# EAGLE schematic bfc (EAGLE 9.6.1)

## Sheet 1 of 5: Flight Computers & PC104 Header
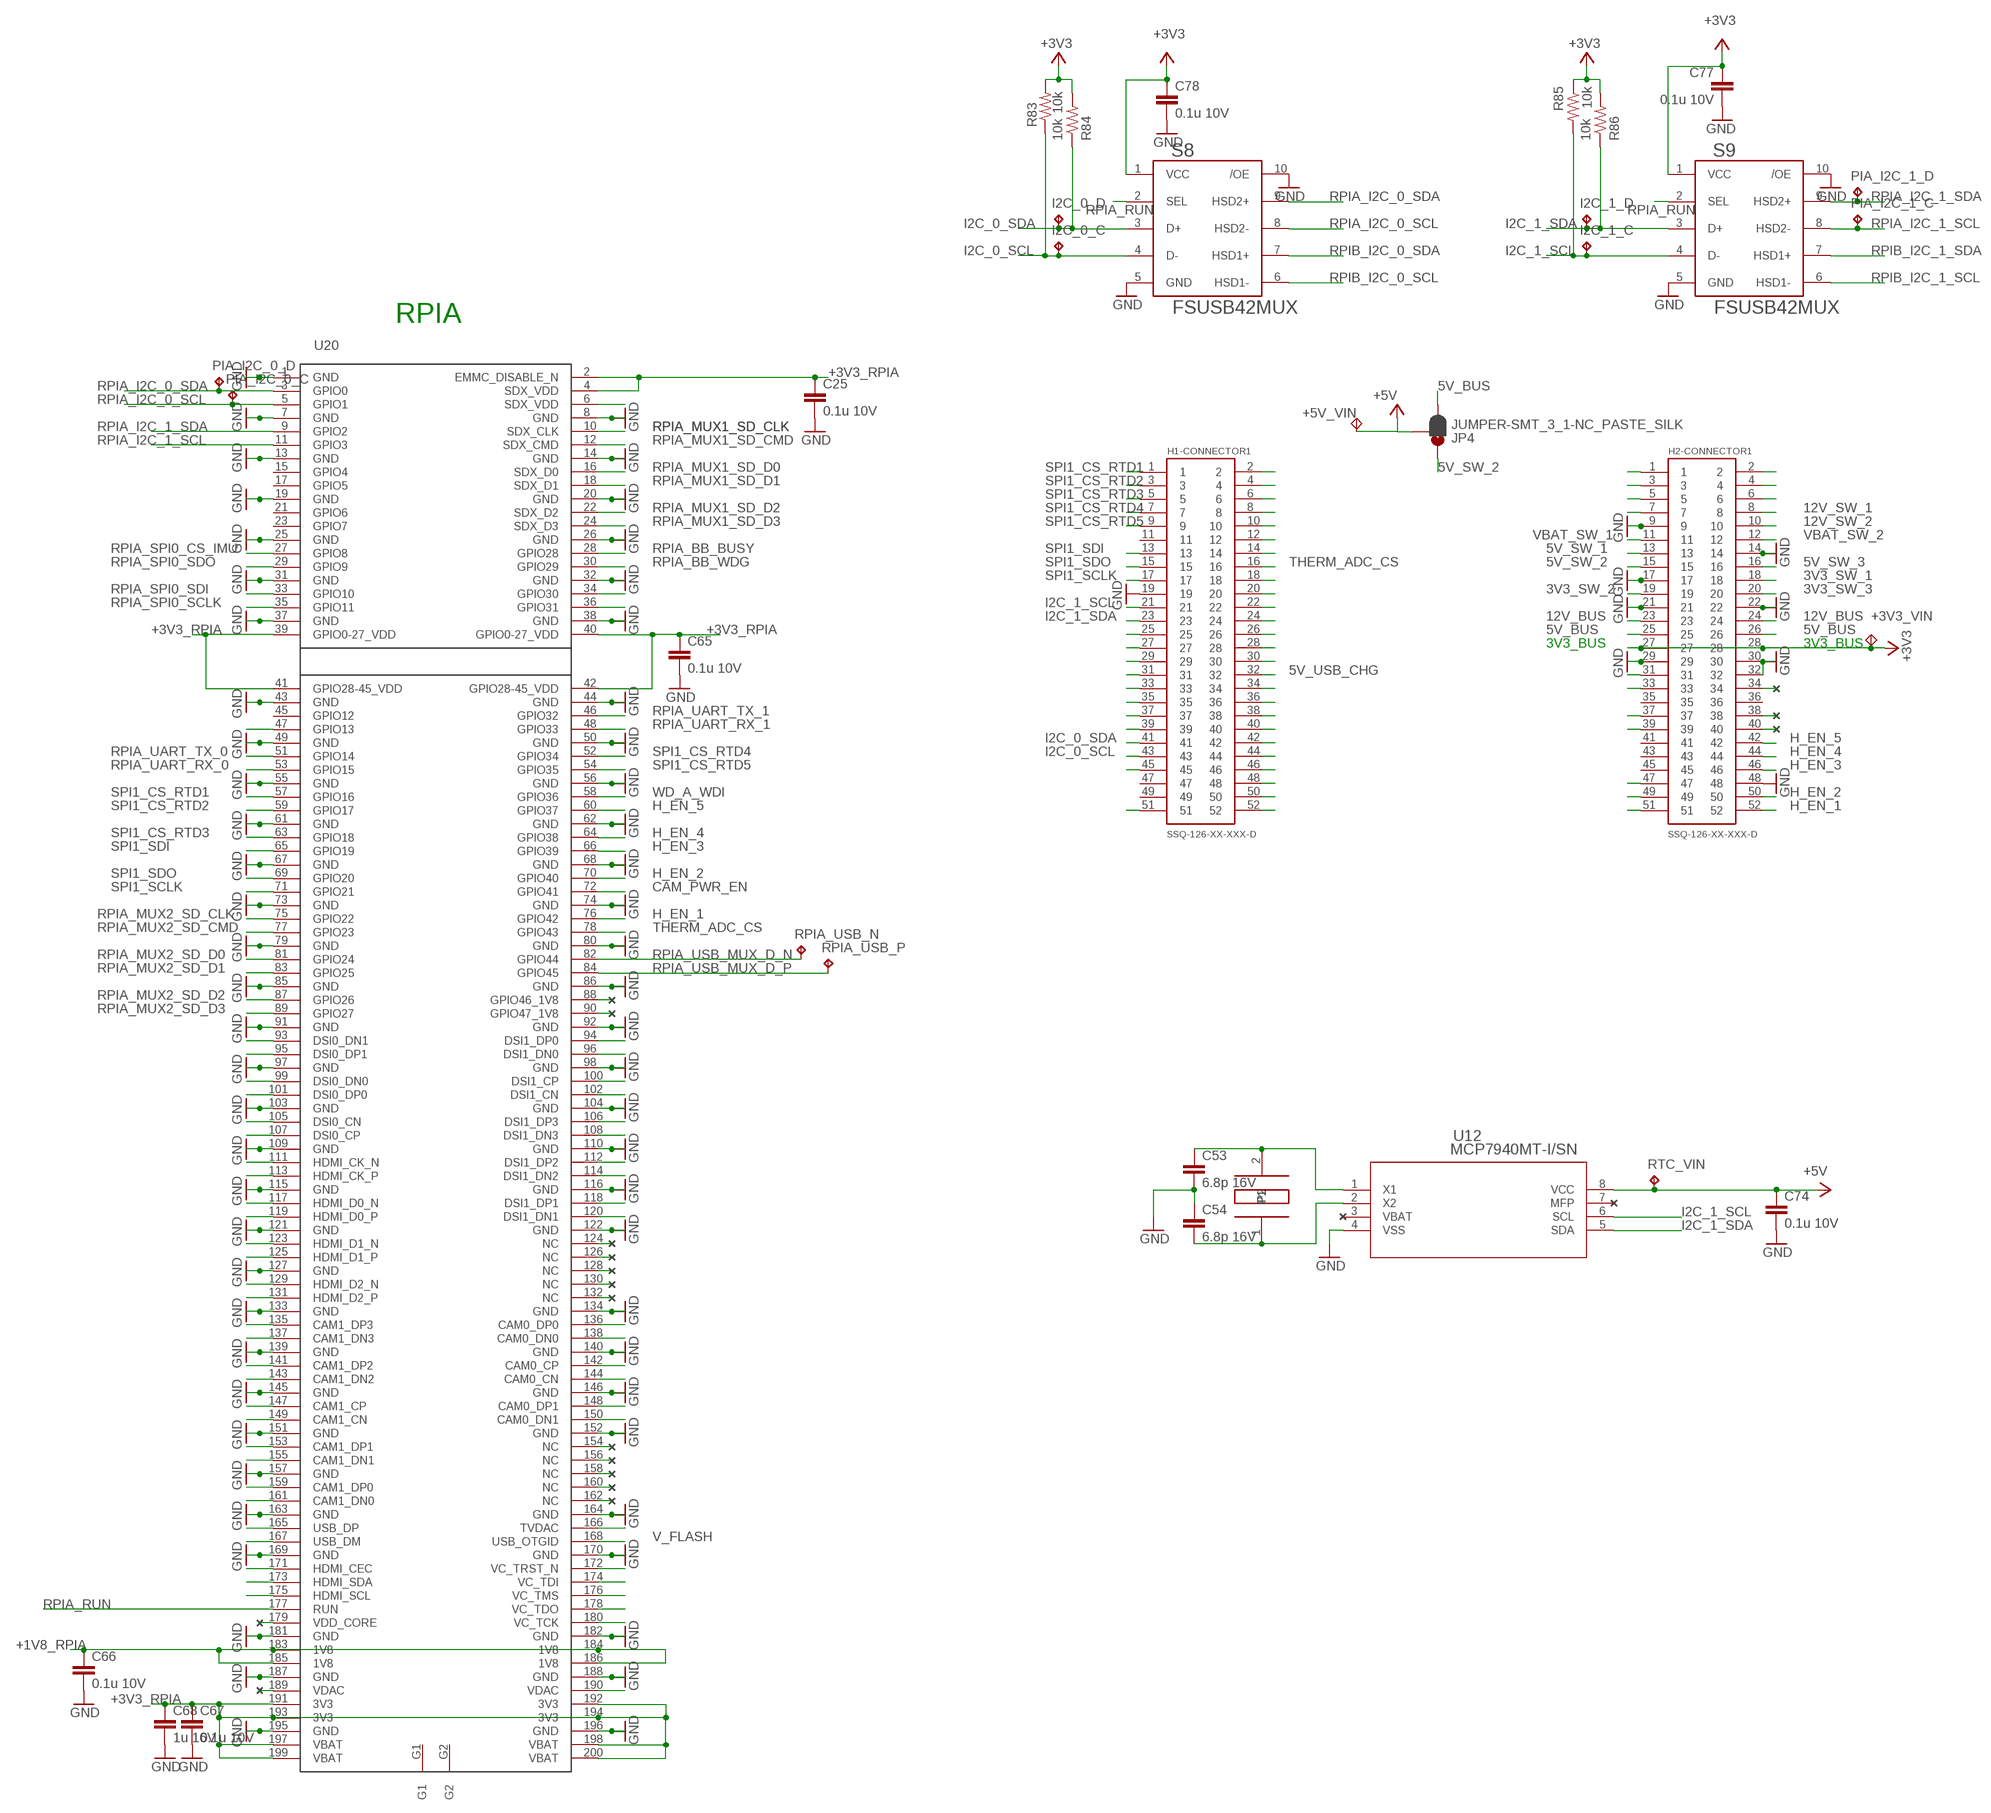
[diagram p0: schematic, sheet 1, part 1 of 2]
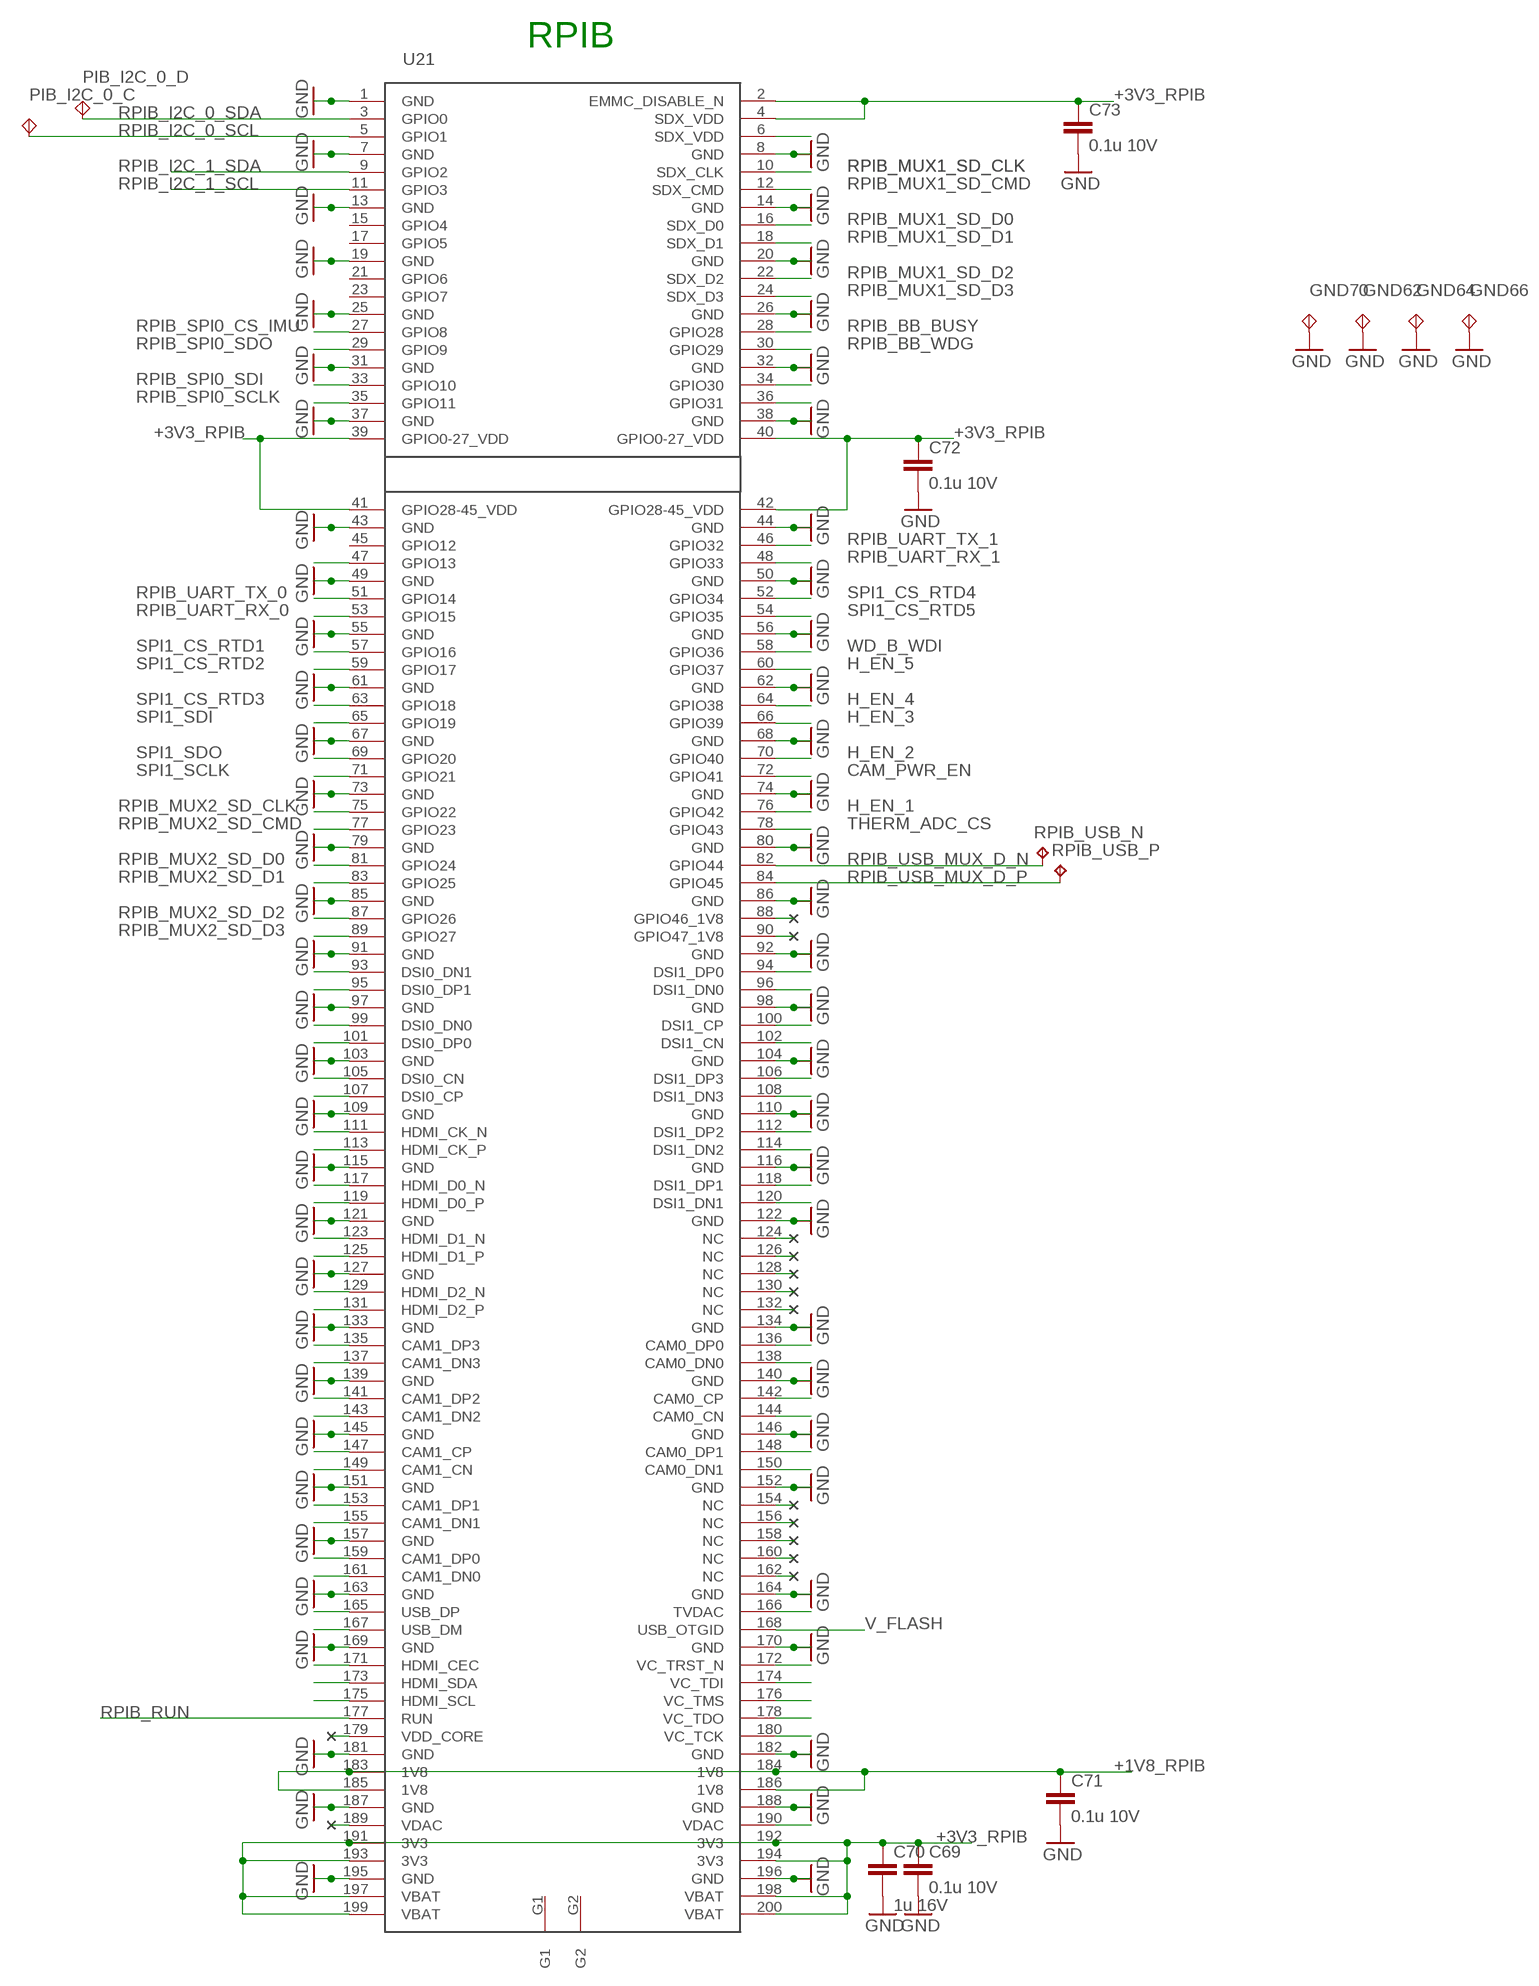
[diagram p1: schematic, sheet 1, part 2 of 2]

### Parts
+3V3_VIN  TP_HRWN  [TP_HRWN]
+5V_VIN  TP_HRWN  [TP_HRWN]
C25  0.1u 10V  C-EUC0603  [C0603]
C53  6.8p 16V  C-EUC0603  [C0603]
C54  6.8p 16V  C-EUC0603  [C0603]
C65  0.1u 10V  C-EUC0603  [C0603]
C66  0.1u 10V  C-EUC0603  [C0603]
C67  0.1u 10V  C-EUC0603  [C0603]
C68  1u 16V  C-EUC0603  [C0603]
C69  0.1u 10V  C-EUC0603  [C0603]
C70  1u 16V  C-EUC0603  [C0603]
C71  0.1u 10V  C-EUC0603  [C0603]
C72  0.1u 10V  C-EUC0603  [C0603]
C73  0.1u 10V  C-EUC0603  [C0603]
C74  0.1u 10V  C-EUC0603  [C0603]
C77  0.1u 10V  C-EUC0603  [C0603]
C78  0.1u 10V  C-EUC0603  [C0603]
GND62  TP_HRWN  [TP_HRWN]
GND64  TP_HRWN  [TP_HRWN]
GND66  TP_HRWN  [TP_HRWN]
GND70  TP_HRWN  [TP_HRWN]
H1-CONNECTOR1  SSQ-126-XX-XXX-D  [SSQ-126-XX-XXX-D]
H2-CONNECTOR1  SSQ-126-XX-XXX-D  [SSQ-126-XX-XXX-D]
I2C_0_C  TPB1,27  [B1,27]
I2C_0_D  TPB1,27  [B1,27]
I2C_1_C  TPB1,27  [B1,27]
I2C_1_D  TPB1,27  [B1,27]
JP4  JUMPER-SMT_3_1-NC_PASTE_SILK  [SMT-JUMPER_3_1-NC_PASTE_SILK]
PIA_I2C_0_C  TPB1,27  [B1,27]
PIA_I2C_0_D  TPB1,27  [B1,27]
PIA_I2C_1_C  TPB1,27  [B1,27]
PIA_I2C_1_D  TPB1,27  [B1,27]
PIB_I2C_0_C  TP_HRWN  [TP_HRWN]
PIB_I2C_0_D  TP_HRWN  [TP_HRWN]
R83  10k  R-US_R0603  [R0603]
R84  10k  R-US_R0603  [R0603]
R85  10k  R-US_R0603  [R0603]
R86  10k  R-US_R0603  [R0603]
RPIA_USB_N  TPB1,27  [B1,27]
RPIA_USB_P  TPB1,27  [B1,27]
RPIB_USB_N  TPB1,27  [B1,27]
RPIB_USB_P  TPB1,27  [B1,27]
RTC_VIN  TPB1,27  [B1,27]
S8  FSUSB42MUX  [FSUSB42MUX]
S9  FSUSB42MUX  [FSUSB42MUX]
U12  MCP7940MT-I/SN  [SOIC8-N_MC]
U20  COMPUTE_MODULE  [SO-DIMM]
U21  COMPUTE_MODULE  [SO-DIMM]
X4  TC-135  [TC-135]

### Nets
3V3_SW_1 [Power]: H2-CONNECTOR1.18
3V3_SW_2 [Power]: H2-CONNECTOR1.19 ; also sheet 4
3V3_SW_3 [Power]: H2-CONNECTOR1.20 ; also sheet 2
5V_BUS [Power]: H2-CONNECTOR1.25 H2-CONNECTOR1.26 JP4.3 ; also sheet 4
5V_SW_1 [Power]: H2-CONNECTOR1.13
5V_SW_2 [Power]: H2-CONNECTOR1.15 JP4.1
5V_SW_3 [Power]: H2-CONNECTOR1.16
5V_USB_CHG [Power]: H1-CONNECTOR1.32
12V_BUS [Power]: H2-CONNECTOR1.23 H2-CONNECTOR1.24 ; also sheet 4
12V_SW_1 [Power]: H2-CONNECTOR1.8 ; also sheet 2
12V_SW_2 [Power]: H2-CONNECTOR1.10
+1V8_RPIA [Power]: C66.1 U20.183(1V8) U20.184(1V8) U20.185(1V8) U20.186(1V8) ; also sheet 4,5
+1V8_RPIB [Power]: C71.1 U21.183(1V8) U21.184(1V8) U21.185(1V8) U21.186(1V8) ; also sheet 4,5
+3V3 [Power]: +3V3_VIN.P$1(P1) C77.1 C78.1 H2-CONNECTOR1.27 H2-CONNECTOR1.28 R83.2 R84.2 R85.1 R86.2 S8.1(VCC) S9.1(VCC) ; also sheet 2,3,4,5
+3V3_RPIA [Power]: C25.1 C65.1 C67.1 C68.1 U20.2(EMMC_DISABLE_N) U20.4(SDX_VDD) U20.39(GPIO0-27_VDD) U20.40(GPIO0-27_VDD) U20.41(GPIO28-45_VDD) U20.42(GPIO28-45_VDD) U20.191(3V3) U20.192(3V3) U20.193(3V3) U20.194(3V3) U20.197(VBAT) U20.198(VBAT) U20.199(VBAT) U20.200(VBAT) ; also sheet 3,5
+3V3_RPIB [Power]: C69.1 C70.1 C72.1 C73.1 U21.2(EMMC_DISABLE_N) U21.4(SDX_VDD) U21.39(GPIO0-27_VDD) U21.40(GPIO0-27_VDD) U21.41(GPIO28-45_VDD) U21.42(GPIO28-45_VDD) U21.191(3V3) U21.192(3V3) U21.193(3V3) U21.194(3V3) U21.197(VBAT) U21.198(VBAT) U21.199(VBAT) U21.200(VBAT) ; also sheet 3,5
+5V [Power]: +5V_VIN.P$1(P1) C74.1 JP4.2 RTC_VIN.TP U12.8(VCC) ; also sheet 2,4,5
CAM_PWR_EN: U20.72(GPIO41) U21.72(GPIO41) ; also sheet 2
GND: C25.2 C53.2 C54.1 C65.2 C66.2 C67.2 C68.2 C69.2 C70.2 C71.2 C72.2 C73.2 C74.2 C77.2 C78.2 GND62.P$1(P1) GND64.P$1(P1) GND66.P$1(P1) GND70.P$1(P1) H1-CONNECTOR1.19 H2-CONNECTOR1.9 H2-CONNECTOR1.14 H2-CONNECTOR1.17 H2-CONNECTOR1.21 H2-CONNECTOR1.22 H2-CONNECTOR1.29 H2-CONNECTOR1.30 H2-CONNECTOR1.32 H2-CONNECTOR1.48 S8.5(GND) S8.10(/OE) S9.5(GND) S9.10(/OE) U12.4(VSS) U20.1(GND) U20.7(GND) U20.8(GND) U20.13(GND) U20.14(GND) U20.19(GND) U20.20(GND) U20.25(GND) U20.26(GND) U20.31(GND) U20.32(GND) U20.37(GND) U20.38(GND) U20.43(GND) U20.44(GND) U20.49(GND) U20.50(GND) U20.55(GND) U20.56(GND) U20.61(GND) U20.62(GND) U20.67(GND) U20.68(GND) U20.73(GND) U20.74(GND) U20.79(GND) U20.80(GND) U20.85(GND) U20.86(GND) U20.91(GND) U20.92(GND) U20.97(GND) U20.98(GND) U20.103(GND) U20.104(GND) U20.109(GND) U20.110(GND) U20.115(GND) U20.116(GND) U20.121(GND) U20.122(GND) U20.127(GND) U20.133(GND) U20.134(GND) U20.139(GND) U20.140(GND) U20.145(GND) U20.146(GND) U20.151(GND) U20.152(GND) U20.157(GND) U20.163(GND) U20.164(GND) U20.169(GND) U20.170(GND) U20.181(GND) U20.182(GND) U20.187(GND) U20.188(GND) U20.195(GND) U20.196(GND) U21.1(GND) U21.7(GND) U21.8(GND) U21.13(GND) U21.14(GND) U21.19(GND) U21.20(GND) U21.25(GND) U21.26(GND) U21.31(GND) U21.32(GND) U21.37(GND) U21.38(GND) U21.43(GND) U21.44(GND) U21.49(GND) U21.50(GND) U21.55(GND) U21.56(GND) U21.61(GND) U21.62(GND) U21.67(GND) U21.68(GND) U21.73(GND) U21.74(GND) U21.79(GND) U21.80(GND) U21.85(GND) U21.86(GND) U21.91(GND) U21.92(GND) U21.97(GND) U21.98(GND) U21.103(GND) U21.104(GND) U21.109(GND) U21.110(GND) U21.115(GND) U21.116(GND) U21.121(GND) U21.122(GND) U21.127(GND) U21.133(GND) U21.134(GND) U21.139(GND) U21.140(GND) U21.145(GND) U21.146(GND) U21.151(GND) U21.152(GND) U21.157(GND) U21.163(GND) U21.164(GND) U21.169(GND) U21.170(GND) U21.181(GND) U21.182(GND) U21.187(GND) U21.188(GND) U21.195(GND) U21.196(GND) ; also sheet 2,3,4,5
H_EN_1: H2-CONNECTOR1.52 U20.76(GPIO42) U21.76(GPIO42)
H_EN_2: H2-CONNECTOR1.50 U20.70(GPIO40) U21.70(GPIO40)
H_EN_3: H2-CONNECTOR1.46 U20.66(GPIO39) U21.66(GPIO39)
H_EN_4: H2-CONNECTOR1.44 U20.64(GPIO38) U21.64(GPIO38)
H_EN_5: H2-CONNECTOR1.42 U20.60(GPIO37) U21.60(GPIO37)
I2C_0_SCL: H1-CONNECTOR1.43 I2C_0_C.TP R83.1 S8.4(D-)
I2C_0_SDA: H1-CONNECTOR1.41 I2C_0_D.TP R84.1 S8.3(D+)
I2C_1_SCL: H1-CONNECTOR1.21 I2C_1_C.TP R85.2 S9.4(D-) U12.6(SCL) ; also sheet 4
I2C_1_SDA: H1-CONNECTOR1.23 I2C_1_D.TP R86.1 S9.3(D+) U12.5(SDA) ; also sheet 4
N$127: C53.1 U12.1(X1) X4.2
N$128: C54.2 U12.2(X2) X4.1
N$174: U20.6(SDX_VDD)
N$177: U20.34(GPIO30)
N$178: U20.36(GPIO31)
N$181: U20.47(GPIO13)
N$188: U20.93(DSI0_DN1)
N$189: U20.95(DSI0_DP1)
N$190: U20.99(DSI0_DN0)
N$191: U20.101(DSI0_DP0)
N$192: U20.105(DSI0_CN)
N$193: U20.107(DSI0_CP)
N$194: U20.111(HDMI_CK_N)
N$195: U20.113(HDMI_CK_P)
N$196: U20.117(HDMI_D0_N)
N$197: U20.119(HDMI_D0_P)
N$198: U20.123(HDMI_D1_N)
N$199: U20.125(HDMI_D1_P)
N$200: U20.129(HDMI_D2_N)
N$201: U20.131(HDMI_D2_P)
N$202: U20.135(CAM1_DP3)
N$203: U20.137(CAM1_DN3)
N$204: U20.154(NC)
N$205: U20.141(CAM1_DP2)
N$206: U20.143(CAM1_DN2)
N$207: U20.156(NC)
N$208: U20.147(CAM1_CP)
N$209: U20.149(CAM1_CN)
N$210: U20.158(NC)
N$211: U20.153(CAM1_DP1)
N$212: U20.155(CAM1_DN1)
N$213: U20.160(NC)
N$214: U20.159(CAM1_DP0)
N$215: U20.161(CAM1_DN0)
N$216: U20.162(NC)
N$217: U20.165(USB_DP)
N$218: U20.167(USB_DM)
N$219: U20.88(GPIO46_1V8)
N$220: U20.171(HDMI_CEC)
N$221: U20.173(HDMI_SDA)
N$222: U20.175(HDMI_SCL)
N$224: U20.90(GPIO47_1V8)
N$225: U20.124(NC)
N$226: U20.126(NC)
N$228: U20.128(NC)
N$229: U20.130(NC)
N$230: U20.132(NC)
N$250: U20.189(VDAC)
N$251: U20.179(VDD_CORE)
N$254: H2-CONNECTOR1.1
N$255: H2-CONNECTOR1.3
N$256: H2-CONNECTOR1.5
N$257: H2-CONNECTOR1.7
N$258: H2-CONNECTOR1.31
N$259: H2-CONNECTOR1.33
N$260: H2-CONNECTOR1.37
N$261: U20.94(DSI1_DP0)
N$262: U20.96(DSI1_DN0)
N$263: H2-CONNECTOR1.39
N$264: U20.100(DSI1_CP)
N$265: U20.102(DSI1_CN)
N$266: H1-CONNECTOR1.25
N$267: U20.106(DSI1_DP3)
N$268: U20.108(DSI1_DN3)
N$269: H1-CONNECTOR1.27
N$270: U20.112(DSI1_DP2)
N$271: U20.114(DSI1_DN2)
N$272: H1-CONNECTOR1.29
N$273: U20.118(DSI1_DP1)
N$274: U20.120(DSI1_DN1)
N$275: H1-CONNECTOR1.31
N$276: H1-CONNECTOR1.33
N$277: H1-CONNECTOR1.35
N$278: H1-CONNECTOR1.37
N$279: H1-CONNECTOR1.39
N$280: H2-CONNECTOR1.47
N$281: H2-CONNECTOR1.49
N$282: U20.136(CAM0_DP0)
N$283: U20.138(CAM0_DN0)
N$284: H1-CONNECTOR1.45
N$285: U20.142(CAM0_CP)
N$286: U20.144(CAM0_CN)
N$287: H2-CONNECTOR1.51
N$288: U20.148(CAM0_DP1)
N$289: U20.150(CAM0_DN1)
N$290: H2-CONNECTOR1.2
N$291: H1-CONNECTOR1.51
N$292: H1-CONNECTOR1.2
N$293: H1-CONNECTOR1.4
N$294: H1-CONNECTOR1.6
N$295: H1-CONNECTOR1.8
N$296: H1-CONNECTOR1.10
N$297: U20.166(TVDAC)
N$299: H1-CONNECTOR1.12
N$300: U20.172(VC_TRST_N)
N$301: U20.174(VC_TDI)
N$302: U20.176(VC_TMS)
N$303: U20.178(VC_TDO)
N$304: U20.180(VC_TCK)
N$305: H1-CONNECTOR1.14
N$309: U20.190(VDAC)
N$310: H1-CONNECTOR1.18
N$311: H1-CONNECTOR1.20
N$312: H1-CONNECTOR1.22
N$315: H1-CONNECTOR1.24
N$316: H1-CONNECTOR1.26
N$317: H1-CONNECTOR1.28
N$318: H1-CONNECTOR1.30
N$319: H2-CONNECTOR1.4
N$320: H1-CONNECTOR1.34
N$321: H1-CONNECTOR1.36
N$322: H1-CONNECTOR1.38
N$323: H1-CONNECTOR1.40
N$324: H1-CONNECTOR1.42
N$325: H1-CONNECTOR1.44
N$326: H1-CONNECTOR1.46
N$327: H1-CONNECTOR1.48
N$328: H1-CONNECTOR1.50
N$329: H1-CONNECTOR1.52
N$330: H2-CONNECTOR1.6
N$331: H2-CONNECTOR1.34
N$332: H2-CONNECTOR1.38
N$333: H2-CONNECTOR1.40
N$341: U21.6(SDX_VDD)
N$344: U21.34(GPIO30)
N$345: U21.36(GPIO31)
N$348: U21.47(GPIO13)
N$355: U21.93(DSI0_DN1)
N$356: U21.95(DSI0_DP1)
N$357: U21.99(DSI0_DN0)
N$358: U21.101(DSI0_DP0)
N$359: U21.105(DSI0_CN)
N$360: U21.107(DSI0_CP)
N$361: U21.111(HDMI_CK_N)
N$362: U21.113(HDMI_CK_P)
N$363: U21.117(HDMI_D0_N)
N$364: U21.119(HDMI_D0_P)
N$365: U21.123(HDMI_D1_N)
N$366: U21.125(HDMI_D1_P)
N$367: U21.129(HDMI_D2_N)
N$368: U21.131(HDMI_D2_P)
N$369: U21.135(CAM1_DP3)
N$370: U21.137(CAM1_DN3)
N$371: U21.141(CAM1_DP2)
N$372: U21.143(CAM1_DN2)
N$373: U21.147(CAM1_CP)
N$374: U21.149(CAM1_CN)
N$375: U21.153(CAM1_DP1)
N$376: U21.155(CAM1_DN1)
N$377: U21.159(CAM1_DP0)
N$378: U21.161(CAM1_DN0)
N$379: U21.165(USB_DP)
N$380: U21.167(USB_DM)
N$381: U21.171(HDMI_CEC)
N$382: U21.173(HDMI_SDA)
N$383: U21.175(HDMI_SCL)
N$399: U21.94(DSI1_DP0)
N$400: U21.96(DSI1_DN0)
N$401: U21.100(DSI1_CP)
N$402: U21.102(DSI1_CN)
N$403: U21.106(DSI1_DP3)
N$404: U21.108(DSI1_DN3)
N$405: U21.112(DSI1_DP2)
N$406: U21.114(DSI1_DN2)
N$407: U21.118(DSI1_DP1)
N$408: U21.120(DSI1_DN1)
N$409: U21.136(CAM0_DP0)
N$410: U21.138(CAM0_DN0)
N$411: U21.142(CAM0_CP)
N$412: U21.144(CAM0_CN)
N$413: U21.148(CAM0_DP1)
N$414: U21.150(CAM0_DN1)
N$415: U21.166(TVDAC)
N$417: U21.172(VC_TRST_N)
N$418: U21.174(VC_TDI)
N$419: U21.176(VC_TMS)
N$420: U21.178(VC_TDO)
N$421: U21.180(VC_TCK)
N$424: U21.190(VDAC)
N$427: U21.154(NC)
N$428: U21.156(NC)
N$429: U21.158(NC)
N$430: U21.160(NC)
N$431: U21.162(NC)
N$432: U21.88(GPIO46_1V8)
N$433: U21.90(GPIO47_1V8)
N$434: U21.124(NC)
N$435: U21.126(NC)
N$436: U21.128(NC)
N$437: U21.130(NC)
N$438: U21.132(NC)
N$447: U21.189(VDAC)
N$448: U21.179(VDD_CORE)
RPIA_BB_BUSY: U20.28(GPIO28) ; also sheet 4
RPIA_BB_WDG: U20.30(GPIO29) ; also sheet 4
RPIA_I2C_0_SCL: PIA_I2C_0_C.TP S8.8(HSD2-) U20.5(GPIO1)
RPIA_I2C_0_SDA: PIA_I2C_0_D.TP S8.9(HSD2+) U20.3(GPIO0)
RPIA_I2C_1_SCL: PIA_I2C_1_C.TP S9.8(HSD2-) U20.11(GPIO3)
RPIA_I2C_1_SDA: PIA_I2C_1_D.TP S9.9(HSD2+) U20.9(GPIO2)
RPIA_MUX1_SD_CLK: U20.10(SDX_CLK) ; also sheet 3
RPIA_MUX1_SD_CMD: U20.12(SDX_CMD) ; also sheet 3
RPIA_MUX1_SD_D0: U20.16(SDX_D0) ; also sheet 3
RPIA_MUX1_SD_D1: U20.18(SDX_D1) ; also sheet 3
RPIA_MUX1_SD_D2: U20.22(SDX_D2) ; also sheet 3
RPIA_MUX1_SD_D3: U20.24(SDX_D3) ; also sheet 3
RPIA_MUX2_SD_CLK: U20.75(GPIO22) ; also sheet 3
RPIA_MUX2_SD_CMD: U20.77(GPIO23) ; also sheet 3
RPIA_MUX2_SD_D0: U20.81(GPIO24) ; also sheet 3
RPIA_MUX2_SD_D1: U20.83(GPIO25) ; also sheet 3
RPIA_MUX2_SD_D2: U20.87(GPIO26) ; also sheet 3
RPIA_MUX2_SD_D3: U20.89(GPIO27) ; also sheet 3
RPIA_RUN: S8.2(SEL) S9.2(SEL) U20.177(RUN) ; also sheet 2,3,4
RPIA_SPI0_CS_IMU: U20.27(GPIO8) ; also sheet 4
RPIA_SPI0_SCLK: U20.35(GPIO11) ; also sheet 4
RPIA_SPI0_SDI: U20.33(GPIO10) ; also sheet 4
RPIA_SPI0_SDO: U20.29(GPIO9) ; also sheet 4
RPIA_UART_RX_0: U20.53(GPIO15) ; also sheet 4
RPIA_UART_RX_1: U20.48(GPIO33) ; also sheet 4
RPIA_UART_TX_0: U20.51(GPIO14) ; also sheet 4
RPIA_UART_TX_1: U20.46(GPIO32) ; also sheet 4
RPIA_USB_MUX_D_N: RPIA_USB_N.TP U20.82(GPIO44) ; also sheet 2
RPIA_USB_MUX_D_P: RPIA_USB_P.TP U20.84(GPIO45) ; also sheet 2
RPIB_BB_BUSY: U21.28(GPIO28) ; also sheet 4
RPIB_BB_WDG: U21.30(GPIO29) ; also sheet 4
RPIB_I2C_0_SCL: PIB_I2C_0_C.P$1(P1) S8.6(HSD1-) U21.5(GPIO1)
RPIB_I2C_0_SDA: PIB_I2C_0_D.P$1(P1) S8.7(HSD1+) U21.3(GPIO0)
RPIB_I2C_1_SCL: S9.6(HSD1-) U21.11(GPIO3)
RPIB_I2C_1_SDA: S9.7(HSD1+) U21.9(GPIO2)
RPIB_MUX1_SD_CLK: U21.10(SDX_CLK) ; also sheet 3
RPIB_MUX1_SD_CMD: U21.12(SDX_CMD) ; also sheet 3
RPIB_MUX1_SD_D0: U21.16(SDX_D0) ; also sheet 3
RPIB_MUX1_SD_D1: U21.18(SDX_D1) ; also sheet 3
RPIB_MUX1_SD_D2: U21.22(SDX_D2) ; also sheet 3
RPIB_MUX1_SD_D3: U21.24(SDX_D3) ; also sheet 3
RPIB_MUX2_SD_CLK: U21.75(GPIO22) ; also sheet 3
RPIB_MUX2_SD_CMD: U21.77(GPIO23) ; also sheet 3
RPIB_MUX2_SD_D0: U21.81(GPIO24) ; also sheet 3
RPIB_MUX2_SD_D1: U21.83(GPIO25) ; also sheet 3
RPIB_MUX2_SD_D2: U21.87(GPIO26) ; also sheet 3
RPIB_MUX2_SD_D3: U21.89(GPIO27) ; also sheet 3
RPIB_RUN: U21.177(RUN) ; also sheet 3
RPIB_SPI0_CS_IMU: U21.27(GPIO8) ; also sheet 4
RPIB_SPI0_SCLK: U21.35(GPIO11) ; also sheet 4
RPIB_SPI0_SDI: U21.33(GPIO10) ; also sheet 4
RPIB_SPI0_SDO: U21.29(GPIO9) ; also sheet 4
RPIB_UART_RX_0: U21.53(GPIO15) ; also sheet 4
RPIB_UART_RX_1: U21.48(GPIO33) ; also sheet 4
RPIB_UART_TX_0: U21.51(GPIO14) ; also sheet 4
RPIB_UART_TX_1: U21.46(GPIO32) ; also sheet 4
RPIB_USB_MUX_D_N: RPIB_USB_N.TP U21.82(GPIO44) ; also sheet 2
RPIB_USB_MUX_D_P: RPIB_USB_P.TP U21.84(GPIO45) ; also sheet 2
SPI1_CS_RTD1: H1-CONNECTOR1.1 U20.57(GPIO16) U21.57(GPIO16)
SPI1_CS_RTD2: H1-CONNECTOR1.3 U20.59(GPIO17) U21.59(GPIO17)
SPI1_CS_RTD3: H1-CONNECTOR1.5 U20.63(GPIO18) U21.63(GPIO18)
SPI1_CS_RTD4: H1-CONNECTOR1.7 U20.52(GPIO34) U21.52(GPIO34)
SPI1_CS_RTD5: H1-CONNECTOR1.9 U20.54(GPIO35) U21.54(GPIO35)
SPI1_SCLK: H1-CONNECTOR1.17 U20.71(GPIO21) U21.71(GPIO21)
SPI1_SDI: H1-CONNECTOR1.13 U20.65(GPIO19) U21.65(GPIO19)
SPI1_SDO: H1-CONNECTOR1.15 U20.69(GPIO20) U21.69(GPIO20)
THERM_ADC_CS: H1-CONNECTOR1.16 U20.78(GPIO43) U21.78(GPIO43)
V_FLASH [Power]: U20.168(USB_OTGID) U21.168(USB_OTGID) ; also sheet 2
VBAT_SW_1 [Power]: H2-CONNECTOR1.11
VBAT_SW_2 [Power]: H2-CONNECTOR1.12
WD_A_WDI: U20.58(GPIO36) ; also sheet 3
WD_B_WDI: U21.58(GPIO36) ; also sheet 3
Unconnected: H1-CONNECTOR1.11 H1-CONNECTOR1.47 H1-CONNECTOR1.49 H2-CONNECTOR1.35 H2-CONNECTOR1.36 H2-CONNECTOR1.41 H2-CONNECTOR1.43 H2-CONNECTOR1.45 U12.7(MFP) U20.15(GPIO4) U20.17(GPIO5) U20.21(GPIO6) U20.23(GPIO7) U20.45(GPIO12) U20.G1 U20.G2 U21.15(GPIO4) U21.17(GPIO5) U21.21(GPIO6) U21.23(GPIO7) U21.45(GPIO12) U21.G1 U21.G2

### Notes on the sheet
- RPIA
- RPIB
- 3V3_BUS | 3V3_BUS

## Sheet 2 of 5: Payload & USB Hub
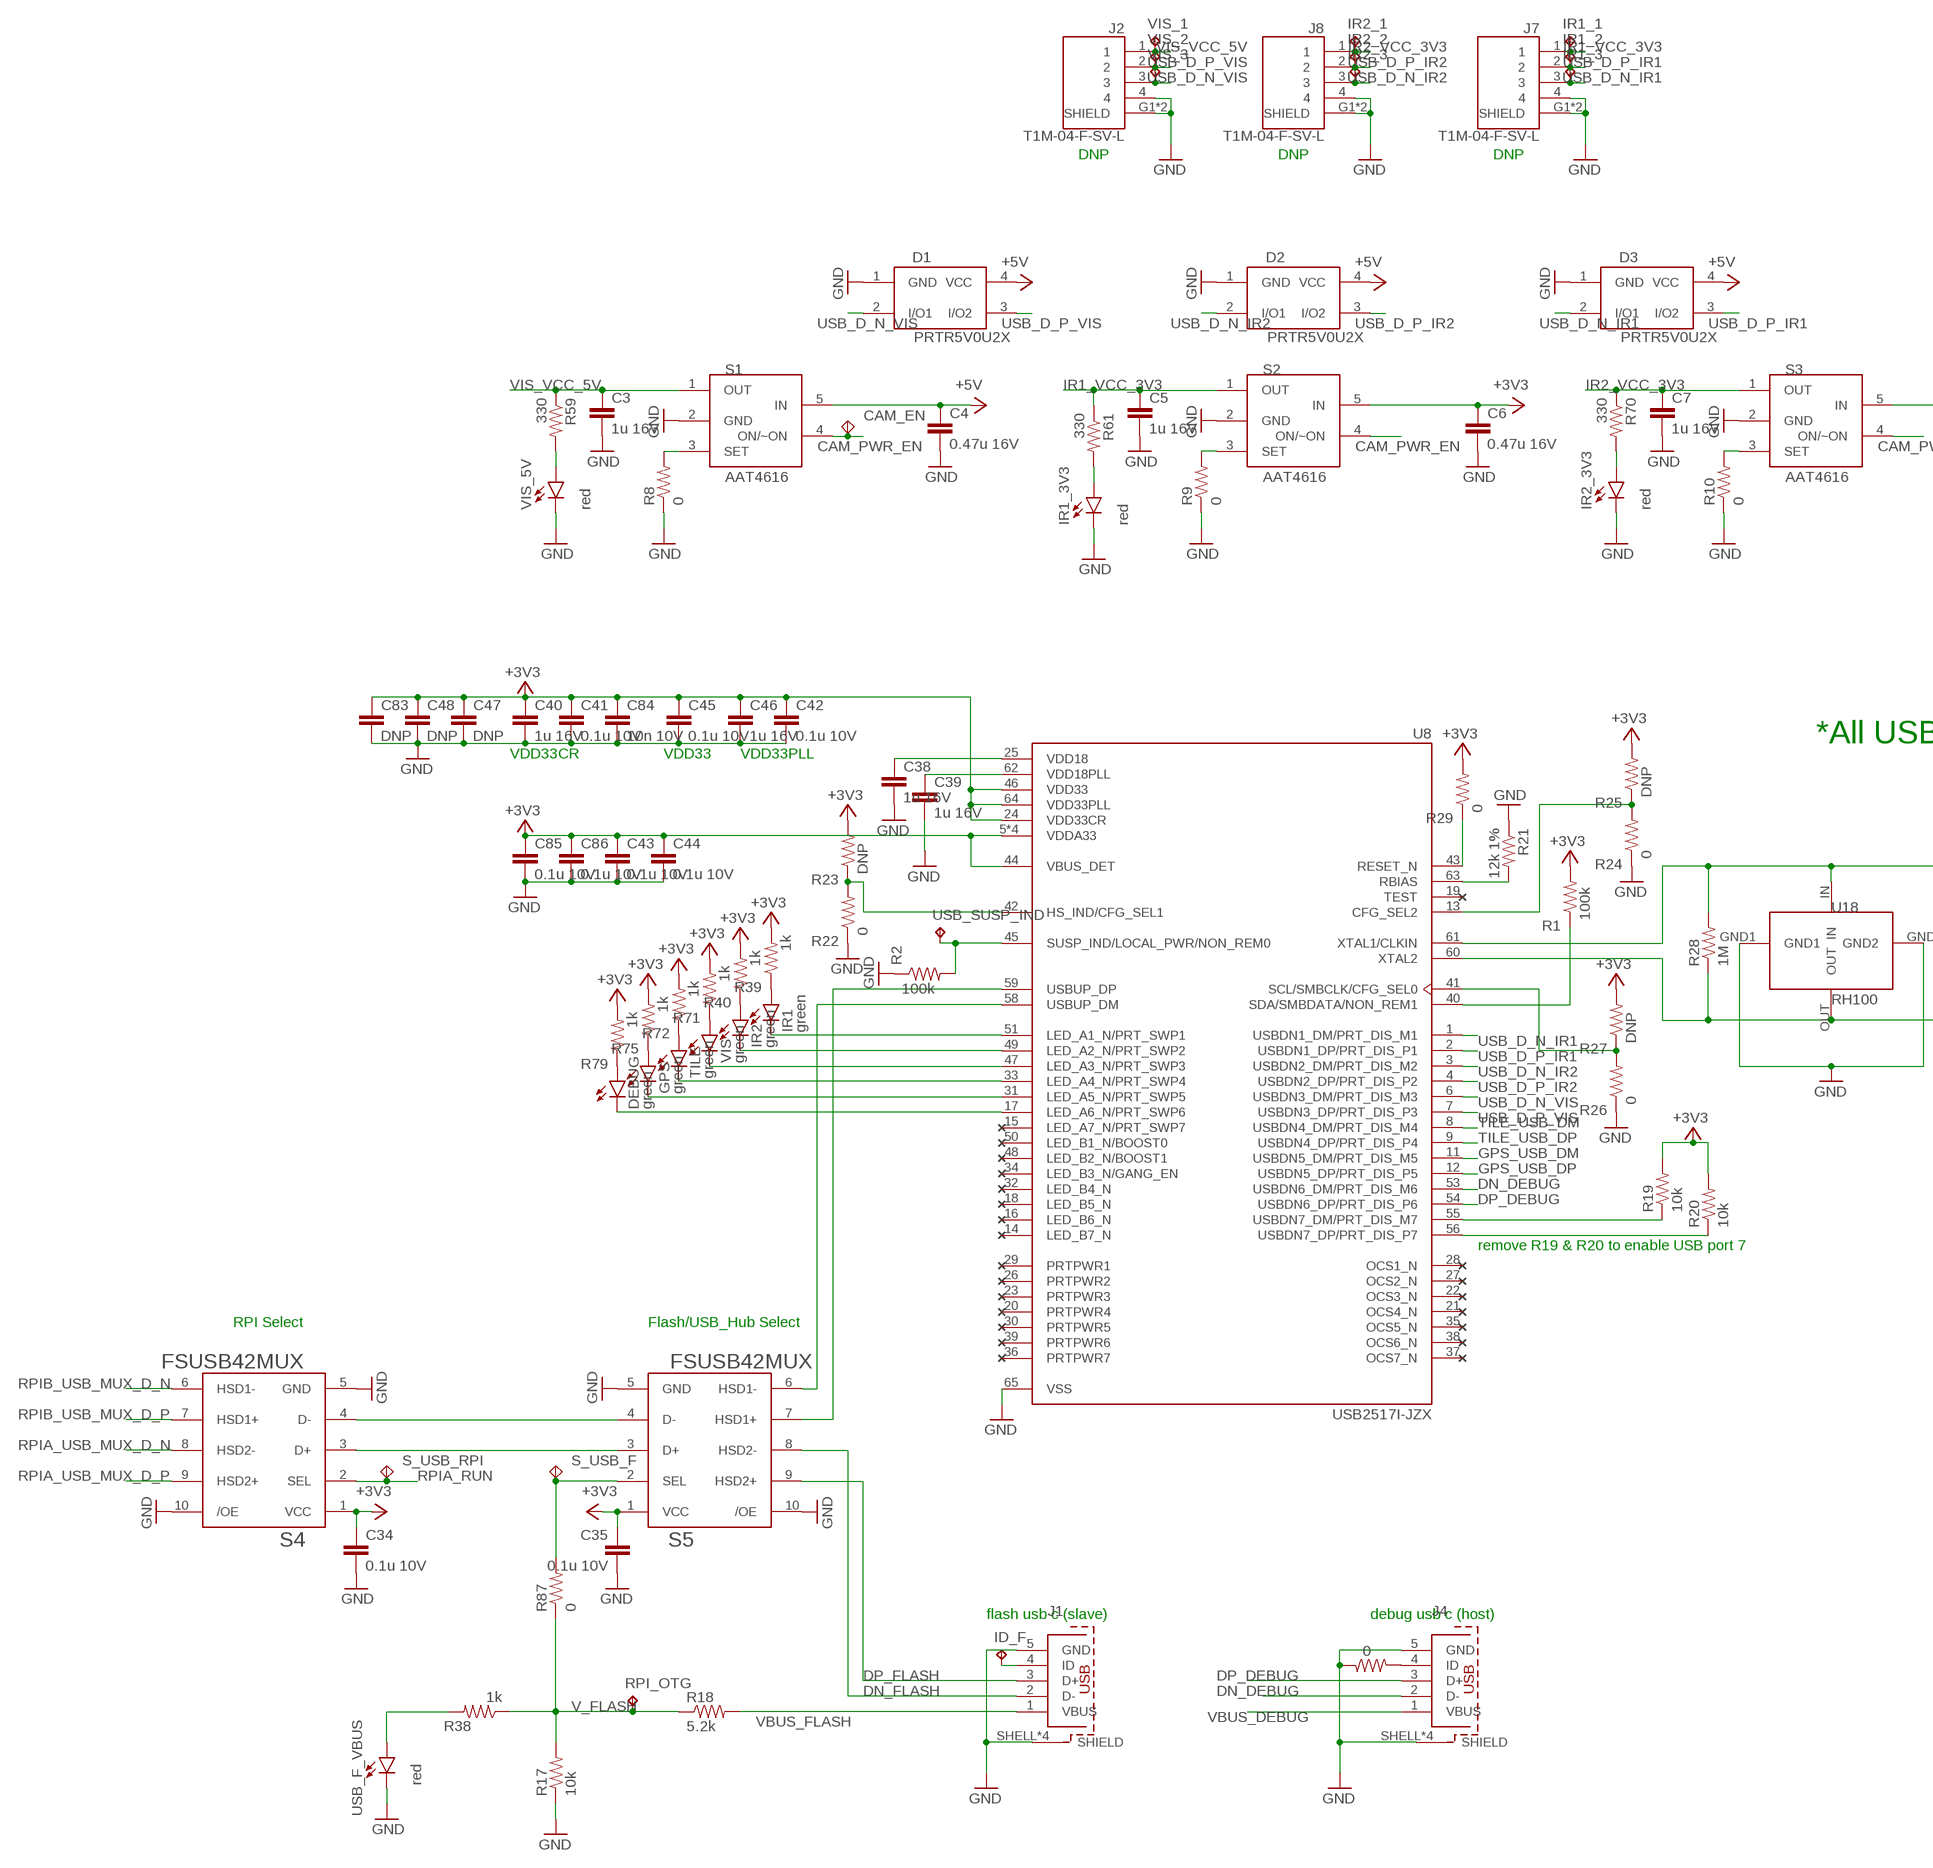
[diagram p2: schematic, sheet 2, part 1 of 2]
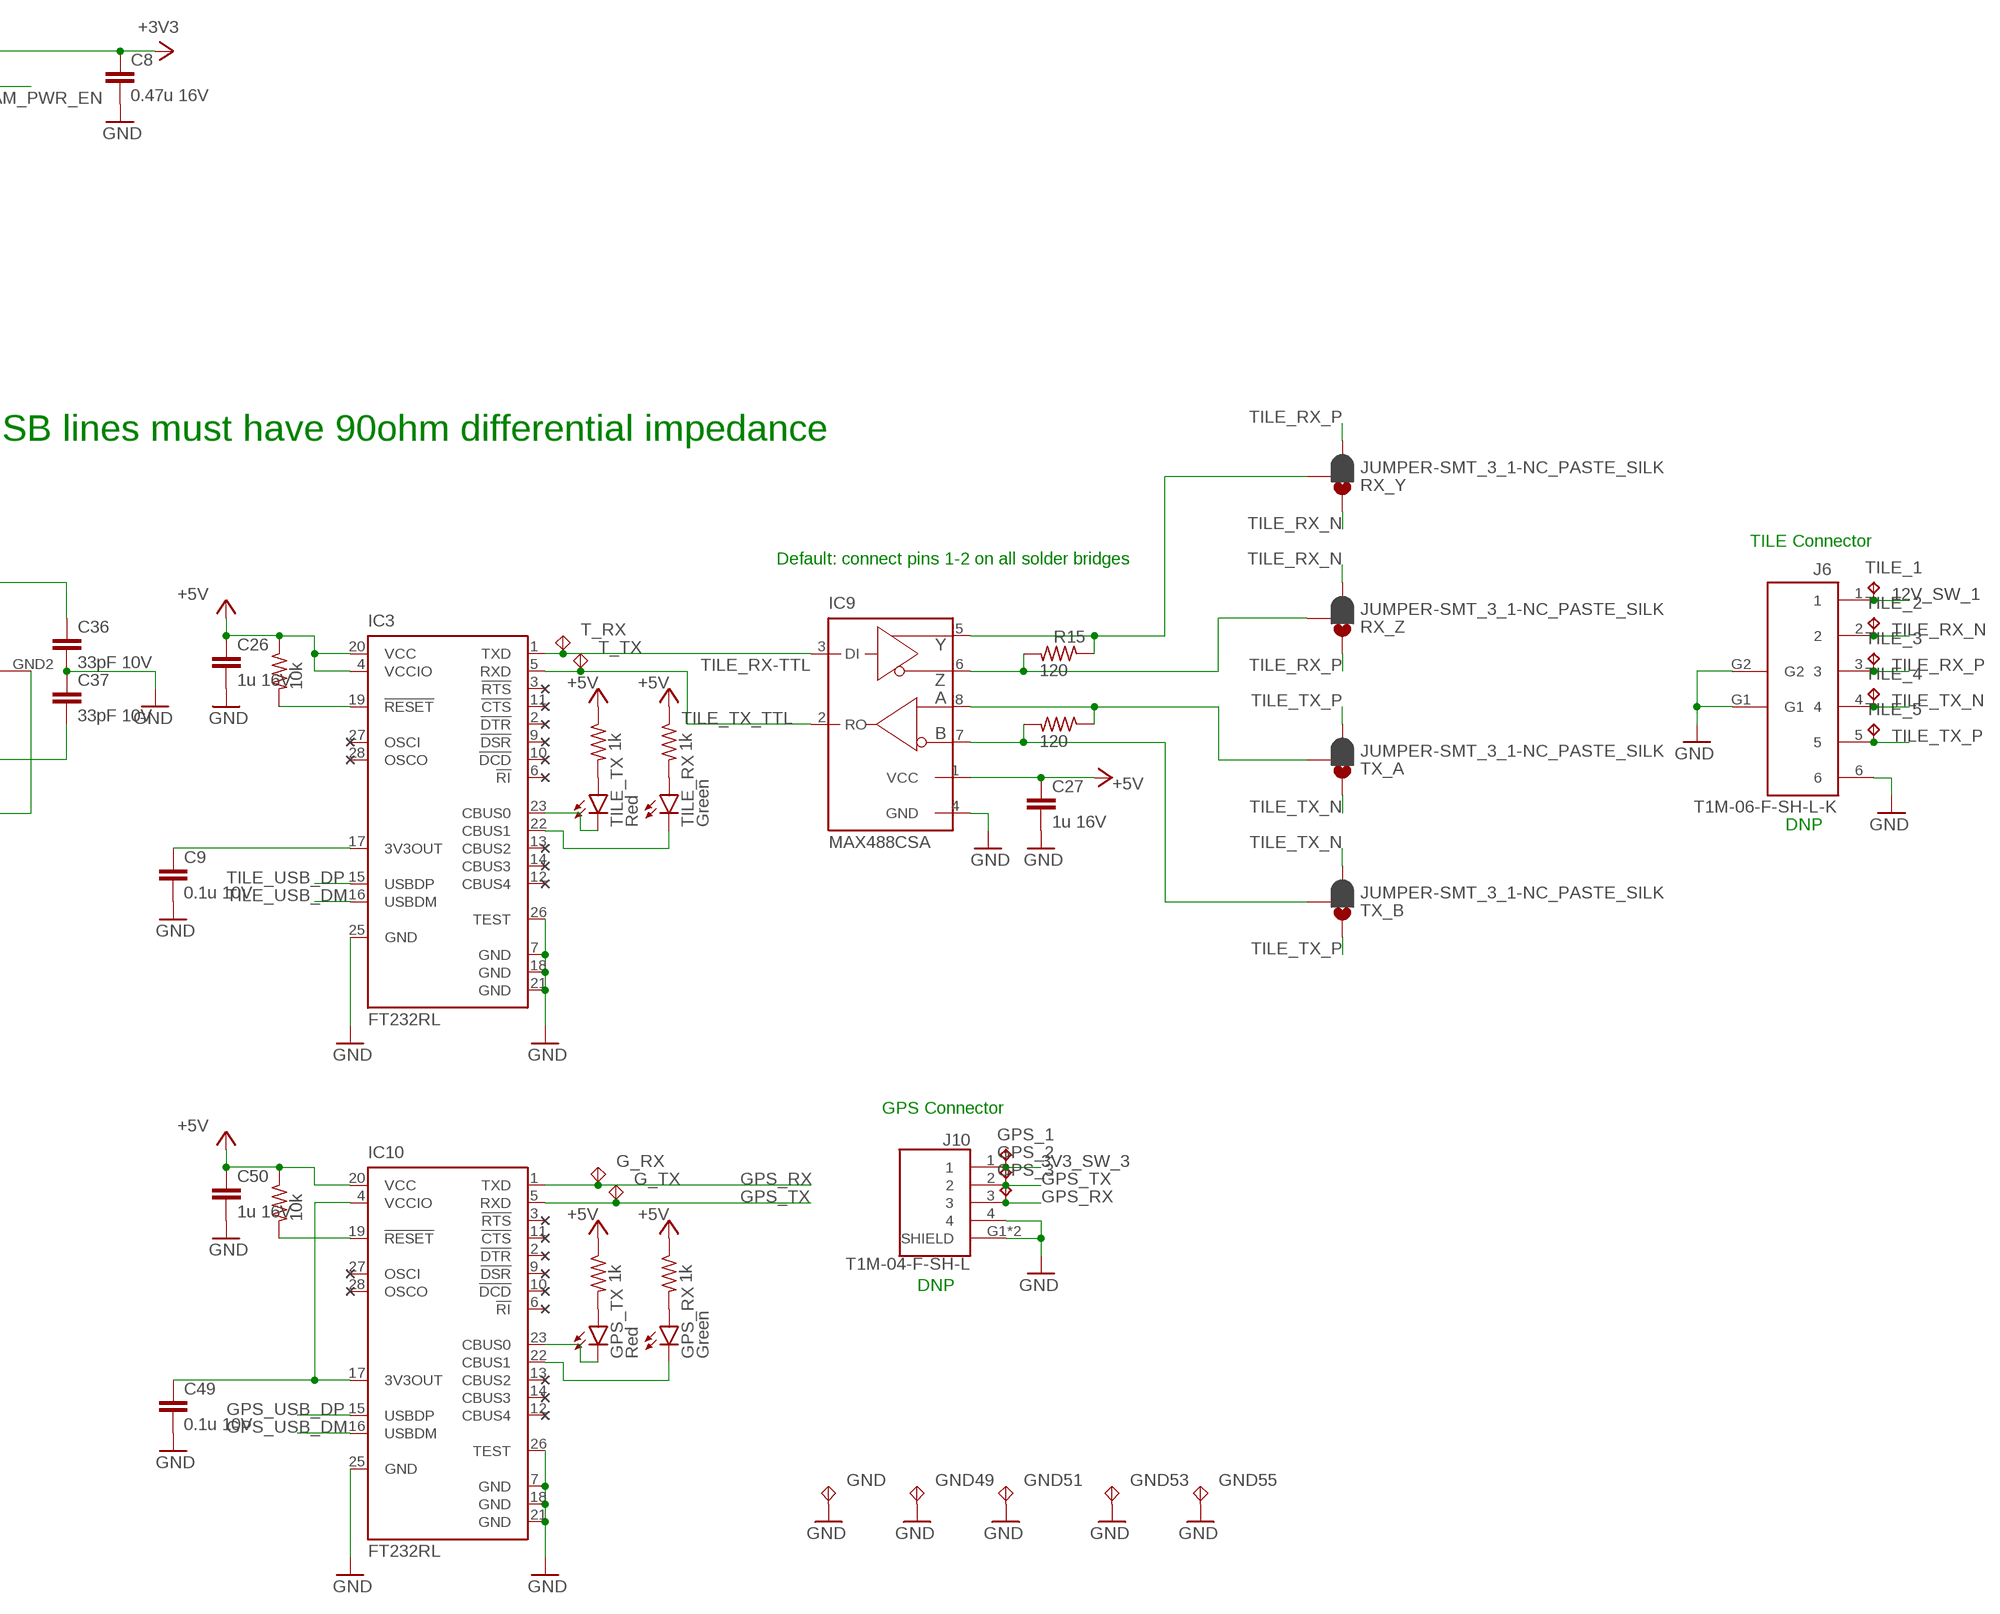
[diagram p3: schematic, sheet 2, part 2 of 2]

### Parts
C3  1u 16V  C-EUC0603  [C0603]
C4  0.47u 16V  C-EUC0603  [C0603]
C5  1u 16V  C-EUC0603  [C0603]
C6  0.47u 16V  C-EUC0603  [C0603]
C7  1u 16V  C-EUC0603  [C0603]
C8  0.47u 16V  C-EUC0603  [C0603]
C9  0.1u 10V  C-EUC0603  [C0603]
C26  1u 16V  C-EUC0603  [C0603]
C27  1u 16V  C-EUC0603  [C0603]
C34  0.1u 10V  C-EUC0603  [C0603]
C35  0.1u 10V  C-EUC0603  [C0603]
C36  33pF 10V  C-EUC0603  [C0603]
C37  33pF 10V  C-EUC0603  [C0603]
C38  1u 16V  C-EUC0603  [C0603]
C39  1u 16V  C-EUC0603  [C0603]
C40  1u 16V  C-EUC0603  [C0603]
C41  0.1u 10V  C-EUC0603  [C0603]
C42  0.1u 10V  C-EUC0603  [C0603]
C43  0.1u 10V  C-EUC0603  [C0603]
C44  0.1u 10V  C-EUC0603  [C0603]
C45  0.1u 10V  C-EUC0603  [C0603]
C46  1u 16V  C-EUC0603  [C0603]
C47  DNP  C-EUC0603  [C0603]
C48  DNP  C-EUC0603  [C0603]
C49  0.1u 10V  C-EUC0603  [C0603]
C50  1u 16V  C-EUC0603  [C0603]
C83  DNP  C-EUC0603  [C0603]
C84  10n 10V  C-EUC0603  [C0603]
C85  0.1u 10V  C-EUC0603  [C0603]
C86  0.1u 10V  C-EUC0603  [C0603]
CAM_EN  TP_HRWN  [TP_HRWN]
D1  PRTR5V0U2X  [PRTR5V0U2X]
D2  PRTR5V0U2X  [PRTR5V0U2X]
D3  PRTR5V0U2X  [PRTR5V0U2X]
DEBUG  green  LEDSML0603  [SML0603]
G_RX  TP_HRWN  [TP_HRWN]
G_TX  TP_HRWN  [TP_HRWN]
GND  TP_HRWN  [TP_HRWN]
GND49  TP_HRWN  [TP_HRWN]
GND51  TP_HRWN  [TP_HRWN]
GND53  TP_HRWN  [TP_HRWN]
GND55  TP_HRWN  [TP_HRWN]
GPS  green  LEDSML0603  [SML0603]
GPS_1  TPTP15SQ  [TP15SQ]
GPS_2  TPTP15SQ  [TP15SQ]
GPS_3  TPTP15SQ  [TP15SQ]
GPS_RX  Green  LEDSML0603  [SML0603]
GPS_TX  Red  LEDSML0603  [SML0603]
IC3  FT232RL  [SSOP28]
IC9  MAX488CSA  [SO08]
IC10  FT232RL  [SSOP28]
ID_F  TPTP18SQ  [TP18SQ]
IR1  green  LEDSML0603  [SML0603]
IR1_1  TPTP15SQ  [TP15SQ]
IR1_2  TPTP15SQ  [TP15SQ]
IR1_3  TPTP15SQ  [TP15SQ]
IR1_3V3  red  LEDSML0603  [SML0603]
IR2  green  LEDSML0603  [SML0603]
IR2_1  TPTP15SQ  [TP15SQ]
IR2_2  TPTP15SQ  [TP15SQ]
IR2_3  TPTP15SQ  [TP15SQ]
IR2_3V3  red  LEDSML0603  [SML0603]
J1  629105150521  [629105150521]
J2  T1M-04-F-SV-L  [SAMTEC_T1M-04-F-SV-L]
J4  629105150521  [629105150521]
J6  T1M-06-F-SH-L-K  [T1M-06-F-SH-L-K]
J7  T1M-04-F-SV-L  [SAMTEC_T1M-04-F-SV-L]
J8  T1M-04-F-SV-L  [SAMTEC_T1M-04-F-SV-L]
J10  T1M-04-F-SH-L  [SAMTEC_T1M-04-F-SH-L]
R1  100k  R-US_R0603  [R0603]
R2  100k  R-US_R0603  [R0603]
R8  0  R-US_R0603  [R0603]
R9  0  R-US_R0603  [R0603]
R10  0  R-US_R0603  [R0603]
R11  10k  R-US_R0603  [R0603]
R12  1k  R-US_R0603  [R0603]
R15  120  R-US_R0603  [R0603]
R16  120  R-US_R0603  [R0603]
R17  10k  R-US_R0603  [R0603]
R18  5.2k  R-US_R0805  [R0805]
R19  10k  R-US_R0603  [R0603]
R20  10k  R-US_R0603  [R0603]
R21  12k 1%  R-US_R0603  [R0603]
R22  0  R-US_R0805  [R0805]
R23  DNP  R-US_R0805  [R0805]
R24  0  R-US_R0603  [R0603]
R25  DNP  R-US_R0603  [R0603]
R26  0  R-US_R0603  [R0603]
R27  DNP  R-US_R0603  [R0603]
R28  1M  R-US_R0603  [R0603]
R29  0  R-US_R0805  [R0805]
R30  1k  R-US_R0603  [R0603]
R31  10k  R-US_R0603  [R0603]
R32  1k  R-US_R0603  [R0603]
R33  1k  R-US_R0603  [R0603]
R37  0  R-US_R0603  [R0603]
R38  1k  R-US_R0603  [R0603]
R39  1k  R-US_R0603  [R0603]
R40  1k  R-US_R0603  [R0603]
R59  330  R-US_R0603  [R0603]
R61  330  R-US_R0603  [R0603]
R70  330  R-US_R0603  [R0603]
R71  1k  R-US_R0603  [R0603]
R72  1k  R-US_R0603  [R0603]
R75  1k  R-US_R0603  [R0603]
R79  1k  R-US_R0603  [R0603]
R87  0  R-US_R0805  [R0805]
RPI_OTG  TPB1,27  [B1,27]
RX_Y  JUMPER-SMT_3_1-NC_PASTE_SILK  [SMT-JUMPER_3_1-NC_PASTE_SILK]
RX_Z  JUMPER-SMT_3_1-NC_PASTE_SILK  [SMT-JUMPER_3_1-NC_PASTE_SILK]
S1  AAT4616  [AAT4616]
S2  AAT4616  [AAT4616]
S3  AAT4616  [AAT4616]
S4  FSUSB42MUX  [FSUSB42MUX]
S5  FSUSB42MUX  [FSUSB42MUX]
S_USB_F  TP_HRWN  [TP_HRWN]
S_USB_RPI  TP_HRWN  [TP_HRWN]
T_RX  TP_HRWN  [TP_HRWN]
T_TX  TP_HRWN  [TP_HRWN]
TILE  green  LEDSML0603  [SML0603]
TILE_1  TPTP15SQ  [TP15SQ]
TILE_2  TPTP15SQ  [TP15SQ]
TILE_3  TPTP15SQ  [TP15SQ]
TILE_4  TPTP15SQ  [TP15SQ]
TILE_5  TPTP15SQ  [TP15SQ]
TILE_RX  Green  LEDSML0603  [SML0603]
TILE_TX  Red  LEDSML0603  [SML0603]
TX_A  JUMPER-SMT_3_1-NC_PASTE_SILK  [SMT-JUMPER_3_1-NC_PASTE_SILK]
TX_B  JUMPER-SMT_3_1-NC_PASTE_SILK  [SMT-JUMPER_3_1-NC_PASTE_SILK]
U8  USB2517I-JZX  [QFN50P900X900X100-65N]
U18  RH100  [RH100]
USB_F_VBUS  red  LEDSML0603  [SML0603]
USB_SUSP_IND  TPTP18SQ  [TP18SQ]
VIS  green  LEDSML0603  [SML0603]
VIS_1  TPTP15SQ  [TP15SQ]
VIS_2  TPTP15SQ  [TP15SQ]
VIS_3  TPTP15SQ  [TP15SQ]
VIS_5V  red  LEDSML0603  [SML0603]

### Nets
3V3_SW_3 [Power]: GPS_1.TP J10.1 ; also sheet 1
12V_SW_1 [Power]: J6.1 TILE_1.TP ; also sheet 1
+3V3 [Power]: C6.1 C8.1 C34.1 C35.1 C40.1 C41.1 C42.1 C43.1 C44.1 C45.1 C46.1 C47.1 C48.1 C83.1 C84.1 C85.1 C86.1 R1.2 R19.2 R20.2 R23.2 R25.2 R27.2 R29.2 R39.2 R40.2 R71.2 R72.2 R75.2 R79.2 S2.5(IN) S3.5(IN) S4.1(VCC) S5.1(VCC) U8.5(VDDA33) U8.10(VDDA33) U8.24(VDD33CR) U8.44(VBUS_DET) U8.46(VDD33) U8.52(VDDA33) U8.57(VDDA33) U8.64(VDD33PLL) ; also sheet 1,3,4,5
+5V [Power]: C4.1 C26.1 C27.1 C50.1 D1.4(VCC) D2.4(VCC) D3.4(VCC) IC3.4(VCCIO) IC3.20(VCC) IC9.1(VCC) IC10.20(VCC) R11.1 R12.1 R30.1 R31.1 R32.1 R33.1 S1.5(IN) ; also sheet 1,4,5
CAM_PWR_EN: CAM_EN.P$1(P1) S1.4(ON/~ON) S2.4(ON/~ON) S3.4(ON/~ON) ; also sheet 1
DN_DEBUG: J4.2(D-) U8.53(USBDN6_DM/PRT_DIS_M6)
DN_FLASH: J1.2(D-) S5.8(HSD2-)
DP_DEBUG: J4.3(D+) U8.54(USBDN6_DP/PRT_DIS_P6)
DP_FLASH: J1.3(D+) S5.9(HSD2+)
GND: C3.2 C4.2 C5.2 C6.2 C7.2 C8.2 C9.2 C26.2 C27.2 C34.2 C35.2 C36.2 C37.1 C38.2 C39.2 C40.2 C41.2 C42.2 C43.2 C44.2 C45.2 C46.2 C47.2 C48.2 C49.2 C50.2 C83.2 C84.2 C85.2 C86.2 D1.1(GND) D2.1(GND) D3.1(GND) GND49.P$1(P1) GND51.P$1(P1) GND53.P$1(P1) GND55.P$1(P1) GND.P$1(P1) IC3.7(GND) IC3.18(GND) IC3.21(GND) IC3.25(GND) IC3.26(TEST) IC9.4(GND) IC10.7(GND) IC10.18(GND) IC10.21(GND) IC10.25(GND) IC10.26(TEST) IR1_3V3.C IR2_3V3.C J1.5(GND) J1.SHELL1(SHIELD) J1.SHELL2(SHIELD) J1.SHELL3(SHIELD) J1.SHELL(SHIELD) J2.4 J2.G1(SHIELD) J2.G2(SHIELD) J4.5(GND) J4.SHELL1(SHIELD) J4.SHELL2(SHIELD) J4.SHELL3(SHIELD) J4.SHELL(SHIELD) J6.6 J6.G1 J6.G2 J7.4 J7.G1(SHIELD) J7.G2(SHIELD) J8.4 J8.G1(SHIELD) J8.G2(SHIELD) J10.4 J10.G1(SHIELD) J10.G2(SHIELD) R2.1 R8.1 R9.1 R10.1 R17.1 R21.1 R22.1 R24.1 R26.1 R37.1 S1.2(GND) S2.2(GND) S3.2(GND) S4.5(GND) S4.10(/OE) S5.5(GND) S5.10(/OE) U8.65(VSS) U18.GND1 U18.GND2 USB_F_VBUS.C VIS_5V.C ; also sheet 1,3,4,5
GPS_RX: G_RX.P$1(P1) GPS_3.TP IC10.1(TXD) J10.3
GPS_TX: G_TX.P$1(P1) GPS_2.TP IC10.5(RXD) J10.2
GPS_USB_DM: IC10.16(USBDM) U8.11(USBDN5_DM/PRT_DIS_M5)
GPS_USB_DP: IC10.15(USBDP) U8.12(USBDN5_DP/PRT_DIS_P5)
IR1_VCC_3V3: C5.1 IR1_1.TP J7.1 R61.1 S2.1(OUT)
IR2_VCC_3V3: C7.1 IR2_1.TP J8.1 R70.1 S3.1(OUT)
N$4: R10.2 S3.3(SET)
N$5: R8.2 S1.3(SET)
N$6: R9.2 S2.3(SET)
N$9: R22.2 R23.1 U8.42(HS_IND/CFG_SEL1)
N$15: J4.4(ID) R37.2
N$26: R38.2 USB_F_VBUS.A
N$27: IR1.A R39.1
N$28: IR1.C U8.51(LED_A1_N/PRT_SWP1)
N$29: IC3.19(!RESET) R11.2
N$30: R12.2 TILE_TX.A
N$31: R30.2 TILE_RX.A
N$32: IC3.23(CBUS0) TILE_TX.C
N$35: IC9.7(B) R16.2 TX_B.2
N$36: IC3.22(CBUS1) TILE_RX.C
N$37: C9.1 IC3.17(3V3OUT)
N$38: IC10.19(!RESET) R31.2
N$39: GPS_TX.A R32.2
N$40: IR2.C U8.49(LED_A2_N/PRT_SWP2)
N$41: IR2.A R40.1
N$42: R71.1 VIS.A
N$43: R72.1 TILE.A
N$44: GPS.A R75.1
N$45: DEBUG.A R79.1
N$47: U8.47(LED_A3_N/PRT_SWP3) VIS.C
N$48: TILE.C U8.33(LED_A4_N/PRT_SWP4)
N$49: GPS.C U8.31(LED_A5_N/PRT_SWP5)
N$51: R21.2 U8.63(RBIAS)
N$52: DEBUG.C U8.17(LED_A6_N/PRT_SWP6)
N$60 [Power]: R87.2 S5.2(SEL) S_USB_F.P$1(P1)
N$61: IC9.5(Y) R15.1 RX_Y.2
N$62: GPS_RX.A R33.2
N$63: GPS_TX.C IC10.23(CBUS0)
N$64: GPS_RX.C IC10.22(CBUS1)
N$65: ID_F.TP J1.4(ID)
N$70: R1.1 U8.40(SDA/SMBDATA/NON_REM1)
N$77: S4.3(D+) S5.3(D+)
N$78: S4.4(D-) S5.4(D-)
N$91: R26.2 R27.1 U8.41(SCL/SMBCLK/CFG_SEL0)
N$109: S5.6(HSD1-) U8.58(USBUP_DM)
N$110: S5.7(HSD1+) U8.59(USBUP_DP)
N$111: R19.1 U8.55(USBDN7_DM/PRT_DIS_M7)
N$112: R20.1 U8.56(USBDN7_DP/PRT_DIS_P7)
N$113: R24.2 R25.1 U8.13(CFG_SEL2)
N$115: C36.1 R28.2 U8.61(XTAL1/CLKIN) U18.IN
N$116: C49.1 IC10.4(VCCIO) IC10.17(3V3OUT)
N$117: C38.1 U8.25(VDD18)
N$118: C37.2 R28.1 U8.60(XTAL2) U18.OUT
N$119: C39.1 U8.62(VDD18PLL)
N$120: R2.2 U8.45(SUSP_IND/LOCAL_PWR/NON_REM0) USB_SUSP_IND.TP
N$122: R29.1 U8.43(RESET_N)
N$129: IC9.6(Z) R15.2 RX_Z.2
N$130: IC9.8(A) R16.1 TX_A.2
N$164: IR1_3V3.A R61.2
N$165: IR2_3V3.A R70.2
N$166: R59.2 VIS_5V.A
RPIA_RUN: S4.2(SEL) S_USB_RPI.P$1(P1) ; also sheet 1,3,4
RPIA_USB_MUX_D_N: S4.8(HSD2-) ; also sheet 1
RPIA_USB_MUX_D_P: S4.9(HSD2+) ; also sheet 1
RPIB_USB_MUX_D_N: S4.6(HSD1-) ; also sheet 1
RPIB_USB_MUX_D_P: S4.7(HSD1+) ; also sheet 1
TILE_RX-TTL: IC3.1(TXD) IC9.3(DI) T_RX.P$1(P1)
TILE_RX_N: J6.2 RX_Y.1 RX_Z.3 TILE_2.TP
TILE_RX_P: J6.3 RX_Y.3 RX_Z.1 TILE_3.TP
TILE_TX_N: J6.4 TILE_4.TP TX_A.1 TX_B.3
TILE_TX_P: J6.5 TILE_5.TP TX_A.3 TX_B.1
TILE_TX_TTL: IC3.5(RXD) IC9.2(RO) T_TX.P$1(P1)
TILE_USB_DM: IC3.16(USBDM) U8.8(USBDN4_DM/PRT_DIS_M4)
TILE_USB_DP: IC3.15(USBDP) U8.9(USBDN4_DP/PRT_DIS_P4)
USB_D_N_IR1: D3.2(I/O1) IR1_3.TP J7.3 U8.1(USBDN1_DM/PRT_DIS_M1)
USB_D_N_IR2: D2.2(I/O1) IR2_3.TP J8.3 U8.3(USBDN2_DM/PRT_DIS_M2)
USB_D_N_VIS: D1.2(I/O1) J2.3 U8.6(USBDN3_DM/PRT_DIS_M3) VIS_3.TP
USB_D_P_IR1: D3.3(I/O2) IR1_2.TP J7.2 U8.2(USBDN1_DP/PRT_DIS_P1)
USB_D_P_IR2: D2.3(I/O2) IR2_2.TP J8.2 U8.4(USBDN2_DP/PRT_DIS_P2)
USB_D_P_VIS: D1.3(I/O2) J2.2 U8.7(USBDN3_DP/PRT_DIS_P3) VIS_2.TP
V_FLASH [Power]: R17.2 R18.1 R38.1 R87.1 RPI_OTG.TP ; also sheet 1
VBUS_DEBUG: J4.1(VBUS)
VBUS_FLASH: J1.1(VBUS) R18.2
VIS_VCC_5V: C3.1 J2.1 R59.1 S1.1(OUT) VIS_1.TP
Unconnected: IC3.2(!DTR) IC3.3(!RTS) IC3.6(!RI) IC3.9(!DSR) IC3.10(!DCD) IC3.11(!CTS) IC3.12(CBUS4) IC3.13(CBUS2) IC3.14(CBUS3) IC3.27(OSCI) IC3.28(OSCO) IC10.2(!DTR) IC10.3(!RTS) IC10.6(!RI) IC10.9(!DSR) IC10.10(!DCD) IC10.11(!CTS) IC10.12(CBUS4) IC10.13(CBUS2) IC10.14(CBUS3) IC10.27(OSCI) IC10.28(OSCO) U8.14(LED_B7_N) U8.15(LED_A7_N/PRT_SWP7) U8.16(LED_B6_N) U8.18(LED_B5_N) U8.19(TEST) U8.20(PRTPWR4) U8.21(OCS4_N) U8.22(OCS3_N) U8.23(PRTPWR3) U8.26(PRTPWR2) U8.27(OCS2_N) U8.28(OCS1_N) U8.29(PRTPWR1) U8.30(PRTPWR5) U8.32(LED_B4_N) U8.34(LED_B3_N/GANG_EN) U8.35(OCS5_N) U8.36(PRTPWR7) U8.37(OCS7_N) U8.38(OCS6_N) U8.39(PRTPWR6) U8.48(LED_B2_N/BOOST1) U8.50(LED_B1_N/BOOST0)

### Notes on the sheet
- DNP | DNP | DNP
- *All USB lines must have 90ohm differential impedance
- VDD33CR | VDD33 | VDD33PLL
- TILE Connector
- Default: connect pins 1-2 on all solder bridges
- DNP
- remove R19 & R20 to enable USB port 7
- RPI Select | Flash/USB_Hub Select | GPS Connector
- DNP
- flash usb c (slave) | debug usb c (host)

## Sheet 3 of 5: SD Interface & RPI Recovery System
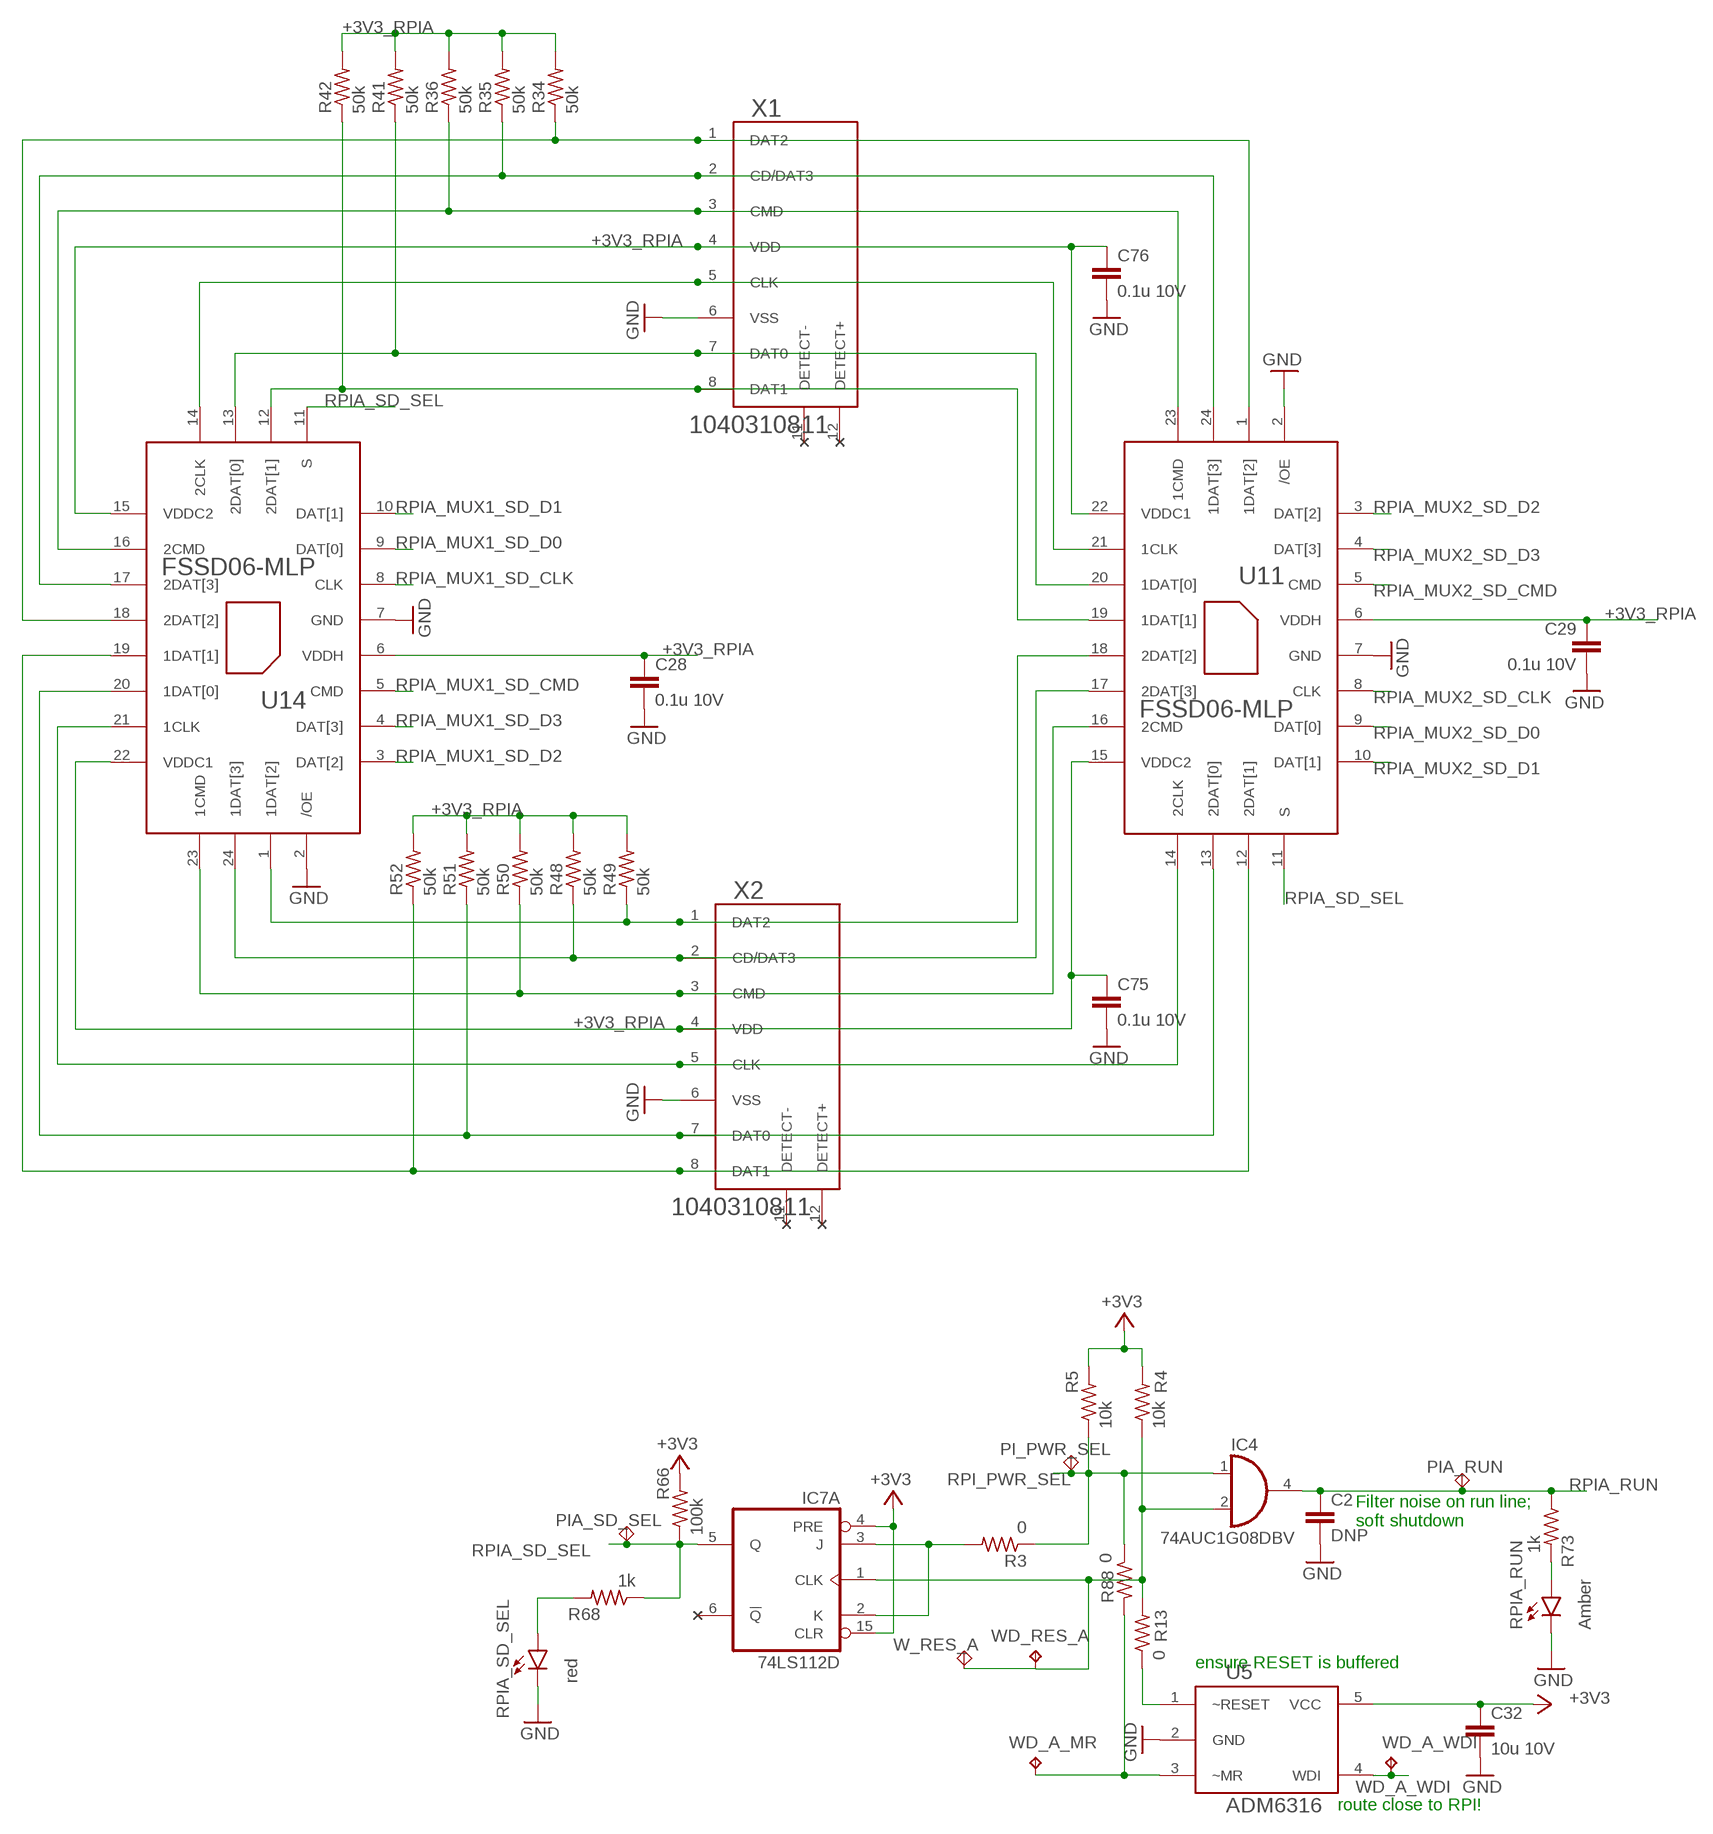
[diagram p4: schematic, sheet 3, part 1 of 2]
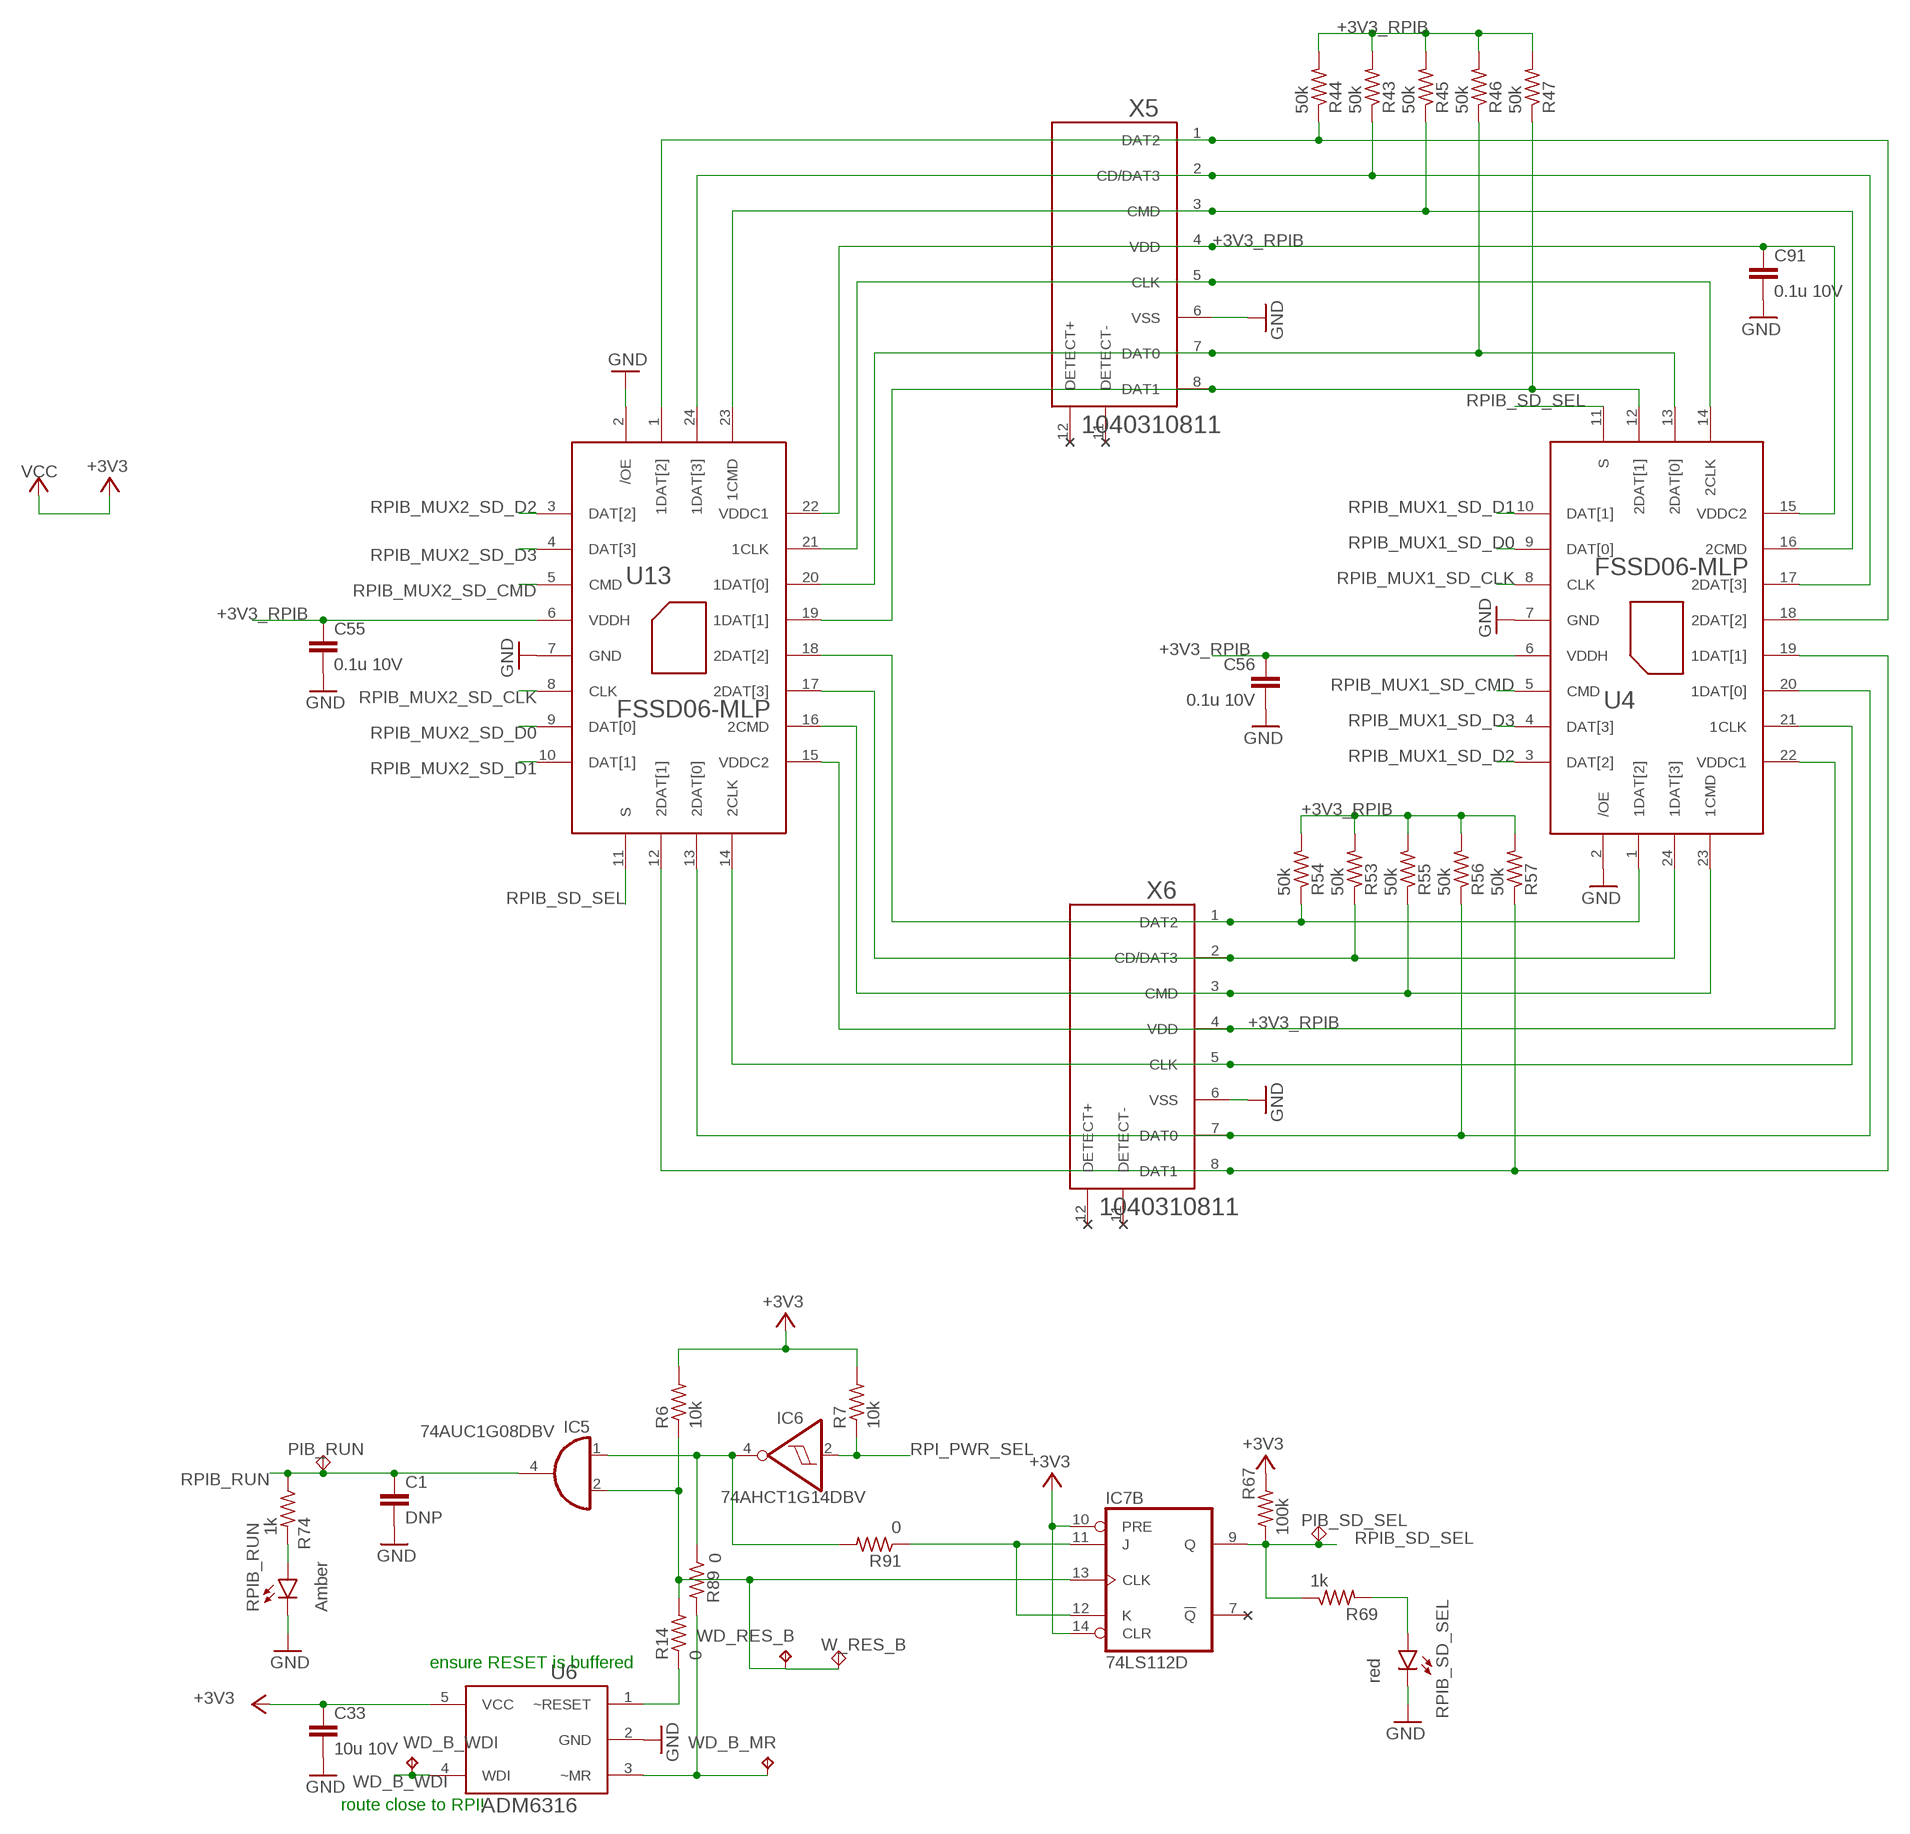
[diagram p5: schematic, sheet 3, part 2 of 2]

### Parts
C1  DNP  C-EUC0603  [C0603]
C2  DNP  C-EUC0603  [C0603]
C28  0.1u 10V  C-EUC0603  [C0603]
C29  0.1u 10V  C-EUC0603  [C0603]
C32  10u 10V  C-EUC0805  [C0805]
C33  10u 10V  C-EUC0805  [C0805]
C55  0.1u 10V  C-EUC0603  [C0603]
C56  0.1u 10V  C-EUC0603  [C0603]
C75  0.1u 10V  C-EUC0603  [C0603]
C76  0.1u 10V  C-EUC0603  [C0603]
C91  0.1u 10V  C-EUC0603  [C0603]
IC4  74AUC1G08DBV  [SOT23-5]
IC5  74AUC1G08DBV  [SOT23-5]
IC6  74AHCT1G14DBV  [SOT23-5]
IC7  74LS112D  [SO16]
PI_PWR_SEL  TP_HRWN  [TP_HRWN]
PIA_RUN  TP_HRWN  [TP_HRWN]
PIA_SD_SEL  TP_HRWN  [TP_HRWN]
PIB_RUN  TP_HRWN  [TP_HRWN]
PIB_SD_SEL  TP_HRWN  [TP_HRWN]
R3  0  R-US_R0603  [R0603]
R4  10k  R-US_R0603  [R0603]
R5  10k  R-US_R0603  [R0603]
R6  10k  R-US_R0603  [R0603]
R7  10k  R-US_R0603  [R0603]
R13  0  R-US_R0603  [R0603]
R14  0  R-US_R0603  [R0603]
R34  50k  R-US_R0603  [R0603]
R35  50k  R-US_R0603  [R0603]
R36  50k  R-US_R0603  [R0603]
R41  50k  R-US_R0603  [R0603]
R42  50k  R-US_R0603  [R0603]
R43  50k  R-US_R0603  [R0603]
R44  50k  R-US_R0603  [R0603]
R45  50k  R-US_R0603  [R0603]
R46  50k  R-US_R0603  [R0603]
R47  50k  R-US_R0603  [R0603]
R48  50k  R-US_R0603  [R0603]
R49  50k  R-US_R0603  [R0603]
R50  50k  R-US_R0603  [R0603]
R51  50k  R-US_R0603  [R0603]
R52  50k  R-US_R0603  [R0603]
R53  50k  R-US_R0603  [R0603]
R54  50k  R-US_R0603  [R0603]
R55  50k  R-US_R0603  [R0603]
R56  50k  R-US_R0603  [R0603]
R57  50k  R-US_R0603  [R0603]
R66  100k  R-US_R0603  [R0603]
R67  100k  R-US_R0603  [R0603]
R68  1k  R-US_R0603  [R0603]
R69  1k  R-US_R0603  [R0603]
R73  1k  R-US_R0603  [R0603]
R74  1k  R-US_R0603  [R0603]
R88  0  R-US_R0603  [R0603]
R89  0  R-US_R0603  [R0603]
R91  0  R-US_R0603  [R0603]
RPIA_RUN  Amber  LEDSML0603  [SML0603]
RPIA_SD_SEL  red  LEDSML0603  [SML0603]
RPIB_RUN  Amber  LEDSML0603  [SML0603]
RPIB_SD_SEL  red  LEDSML0603  [SML0603]
U4  FSSD06-MLP  [FSSD06-MLP]
U5  ADM6316  AMD6316  [AMD6316]
U6  ADM6316  AMD6316  [AMD6316]
U11  FSSD06-MLP  [FSSD06-MLP]
U13  FSSD06-MLP  [FSSD06-MLP]
U14  FSSD06-MLP  [FSSD06-MLP]
W_RES_A  TP_HRWN  [TP_HRWN]
W_RES_B  TP_HRWN  [TP_HRWN]
WD_A_MR  TPTP18SQ  [TP18SQ]
WD_A_WDI  TPB1,27  [B1,27]
WD_B_MR  TPTP18SQ  [TP18SQ]
WD_B_WDI  TPB1,27  [B1,27]
WD_RES_A  TPTP18SQ  [TP18SQ]
WD_RES_B  TPTP18SQ  [TP18SQ]
X1  1040310811  [1040310811]
X2  1040310811  [1040310811]
X5  1040310811  [1040310811]
X6  1040310811  [1040310811]

### Nets
+3V3 [Power]: C32.1 C33.1 IC7.4(A:PRE) IC7.10(B:PRE) IC7.14(B:CLR) IC7.15(A:CLR) R4.2 R5.2 R6.2 R7.2 R66.2 R67.2 U5.5(VCC) U6.5(VCC) ; supply symbol labelled VCC ; also sheet 1,2,4,5
+3V3_RPIA [Power]: C28.1 C29.1 C75.1 C76.1 R34.2 R35.2 R36.2 R41.2 R42.2 R48.2 R49.2 R50.2 R51.2 R52.2 U11.6(VDDH) U11.15(VDDC2) U11.22(VDDC1) U14.6(VDDH) U14.15(VDDC2) U14.22(VDDC1) X1.4(VDD) X2.4(VDD) ; also sheet 1,5
+3V3_RPIB [Power]: C55.1 C56.1 C91.1 R43.2 R44.2 R45.2 R46.2 R47.2 R53.2 R54.2 R55.2 R56.2 R57.2 U4.6(VDDH) U4.15(VDDC2) U4.22(VDDC1) U13.6(VDDH) U13.15(VDDC2) U13.22(VDDC1) X5.4(VDD) X6.4(VDD) ; also sheet 1,5
GND: C1.2 C2.2 C28.2 C29.2 C32.2 C33.2 C55.2 C56.2 C75.2 C76.2 C91.2 RPIA_RUN.C RPIA_SD_SEL.C RPIB_RUN.C RPIB_SD_SEL.C U4.2(/OE) U4.7(GND) U5.2(GND) U6.2(GND) U11.2(/OE) U11.7(GND) U13.2(/OE) U13.7(GND) U14.2(/OE) U14.7(GND) X1.6(VSS) X2.6(VSS) X5.6(VSS) X6.6(VSS) ; also sheet 1,2,4,5
N$1: R34.1 U11.1(1DAT[2]) U14.18(2DAT[2]) X1.1(DAT2)
N$2: R35.1 U11.24(1DAT[3]) U14.17(2DAT[3]) X1.2(CD/DAT3)
N$3: R36.1 U11.23(1CMD) U14.16(2CMD) X1.3(CMD)
N$7: IC7.2(A:K) IC7.3(A:J) R3.2
N$8: IC7.11(B:J) IC7.12(B:K) R91.1
N$10: R88.2 U5.3(~MR) WD_A_MR.TP
N$11: R89.2 U6.3(~MR) WD_B_MR.TP
N$12: U11.21(1CLK) U14.14(2CLK) X1.5(CLK)
N$13: R41.1 U11.20(1DAT[0]) U14.13(2DAT[0]) X1.7(DAT0)
N$14: R42.1 U11.19(1DAT[1]) U14.12(2DAT[1]) X1.8(DAT1)
N$18: IC4.2(I1) IC7.1(A:CLK) R4.1 R13.2 W_RES_A.P$1(P1) WD_RES_A.TP
N$33: IC5.2(I1) IC7.13(B:CLK) R6.1 R14.2 W_RES_B.P$1(P1) WD_RES_B.TP
N$34: IC5.1(I0) IC6.4(O) R89.1 R91.2
N$53: R48.1 U11.17(2DAT[3]) U14.24(1DAT[3]) X2.2(CD/DAT3)
N$54: R50.1 U11.16(2CMD) U14.23(1CMD) X2.3(CMD)
N$55: U11.14(2CLK) U14.21(1CLK) X2.5(CLK)
N$56: R51.1 U11.13(2DAT[0]) U14.20(1DAT[0]) X2.7(DAT0)
N$68: R13.1 U5.1(~RESET)
N$69: R14.1 U6.1(~RESET)
N$75: R52.1 U11.12(2DAT[1]) U14.19(1DAT[1]) X2.8(DAT1)
N$131: R49.1 U11.18(2DAT[2]) U14.1(1DAT[2]) X2.1(DAT2)
N$134: R44.1 U4.18(2DAT[2]) U13.1(1DAT[2]) X5.1(DAT2)
N$135: R43.1 U4.17(2DAT[3]) U13.24(1DAT[3]) X5.2(CD/DAT3)
N$136: R45.1 U4.16(2CMD) U13.23(1CMD) X5.3(CMD)
N$137: U4.14(2CLK) U13.21(1CLK) X5.5(CLK)
N$138: R46.1 U4.13(2DAT[0]) U13.20(1DAT[0]) X5.7(DAT0)
N$139: R47.1 U4.12(2DAT[1]) U13.19(1DAT[1]) X5.8(DAT1)
N$140: R53.1 U4.24(1DAT[3]) U13.17(2DAT[3]) X6.2(CD/DAT3)
N$141: R55.1 U4.23(1CMD) U13.16(2CMD) X6.3(CMD)
N$142: U4.21(1CLK) U13.14(2CLK) X6.5(CLK)
N$143: R56.1 U4.20(1DAT[0]) U13.13(2DAT[0]) X6.7(DAT0)
N$144: R57.1 U4.19(1DAT[1]) U13.12(2DAT[1]) X6.8(DAT1)
N$145: R54.1 U4.1(1DAT[2]) U13.18(2DAT[2]) X6.1(DAT2)
N$162: R68.2 RPIA_SD_SEL.A
N$163: R69.2 RPIB_SD_SEL.A
N$167: R73.2 RPIA_RUN.A
N$168: R74.2 RPIB_RUN.A
RPI_PWR_SEL: IC4.1(I0) IC6.2(I) PI_PWR_SEL.P$1(P1) R3.1 R5.1 R7.1 R88.1 ; also sheet 4
RPIA_MUX1_SD_CLK: U14.8(CLK) ; also sheet 1
RPIA_MUX1_SD_CMD: U14.5(CMD) ; also sheet 1
RPIA_MUX1_SD_D0: U14.9(DAT[0]) ; also sheet 1
RPIA_MUX1_SD_D1: U14.10(DAT[1]) ; also sheet 1
RPIA_MUX1_SD_D2: U14.3(DAT[2]) ; also sheet 1
RPIA_MUX1_SD_D3: U14.4(DAT[3]) ; also sheet 1
RPIA_MUX2_SD_CLK: U11.8(CLK) ; also sheet 1
RPIA_MUX2_SD_CMD: U11.5(CMD) ; also sheet 1
RPIA_MUX2_SD_D0: U11.9(DAT[0]) ; also sheet 1
RPIA_MUX2_SD_D1: U11.10(DAT[1]) ; also sheet 1
RPIA_MUX2_SD_D2: U11.3(DAT[2]) ; also sheet 1
RPIA_MUX2_SD_D3: U11.4(DAT[3]) ; also sheet 1
RPIA_RUN: C2.1 IC4.4(O) PIA_RUN.P$1(P1) R73.1 ; also sheet 1,2,4
RPIA_SD_SEL: IC7.5(A:Q) PIA_SD_SEL.P$1(P1) R66.1 R68.1 U11.11(S) U14.11(S)
RPIB_MUX1_SD_CLK: U4.8(CLK) ; also sheet 1
RPIB_MUX1_SD_CMD: U4.5(CMD) ; also sheet 1
RPIB_MUX1_SD_D0: U4.9(DAT[0]) ; also sheet 1
RPIB_MUX1_SD_D1: U4.10(DAT[1]) ; also sheet 1
RPIB_MUX1_SD_D2: U4.3(DAT[2]) ; also sheet 1
RPIB_MUX1_SD_D3: U4.4(DAT[3]) ; also sheet 1
RPIB_MUX2_SD_CLK: U13.8(CLK) ; also sheet 1
RPIB_MUX2_SD_CMD: U13.5(CMD) ; also sheet 1
RPIB_MUX2_SD_D0: U13.9(DAT[0]) ; also sheet 1
RPIB_MUX2_SD_D1: U13.10(DAT[1]) ; also sheet 1
RPIB_MUX2_SD_D2: U13.3(DAT[2]) ; also sheet 1
RPIB_MUX2_SD_D3: U13.4(DAT[3]) ; also sheet 1
RPIB_RUN: C1.1 IC5.4(O) PIB_RUN.P$1(P1) R74.1 ; also sheet 1
RPIB_SD_SEL: IC7.9(B:Q) PIB_SD_SEL.P$1(P1) R67.1 R69.1 U4.11(S) U13.11(S)
WD_A_WDI: U5.4(WDI) WD_A_WDI.TP ; also sheet 1
WD_B_WDI: U6.4(WDI) WD_B_WDI.TP ; also sheet 1
Unconnected: IC7.6(A:!Q) IC7.7(B:!Q) X1.11(DETECT-) X1.12(DETECT+) X2.11(DETECT-) X2.12(DETECT+) X5.11(DETECT-) X5.12(DETECT+) X6.11(DETECT-) X6.12(DETECT+)

### Notes on the sheet
- Filter noise on run line;
  soft shutdown
- ensure RESET is buffered | ensure RESET is buffered
- route close to RPI! | route close to RPI!

## Sheet 4 of 5: UART & IMU & Antenna
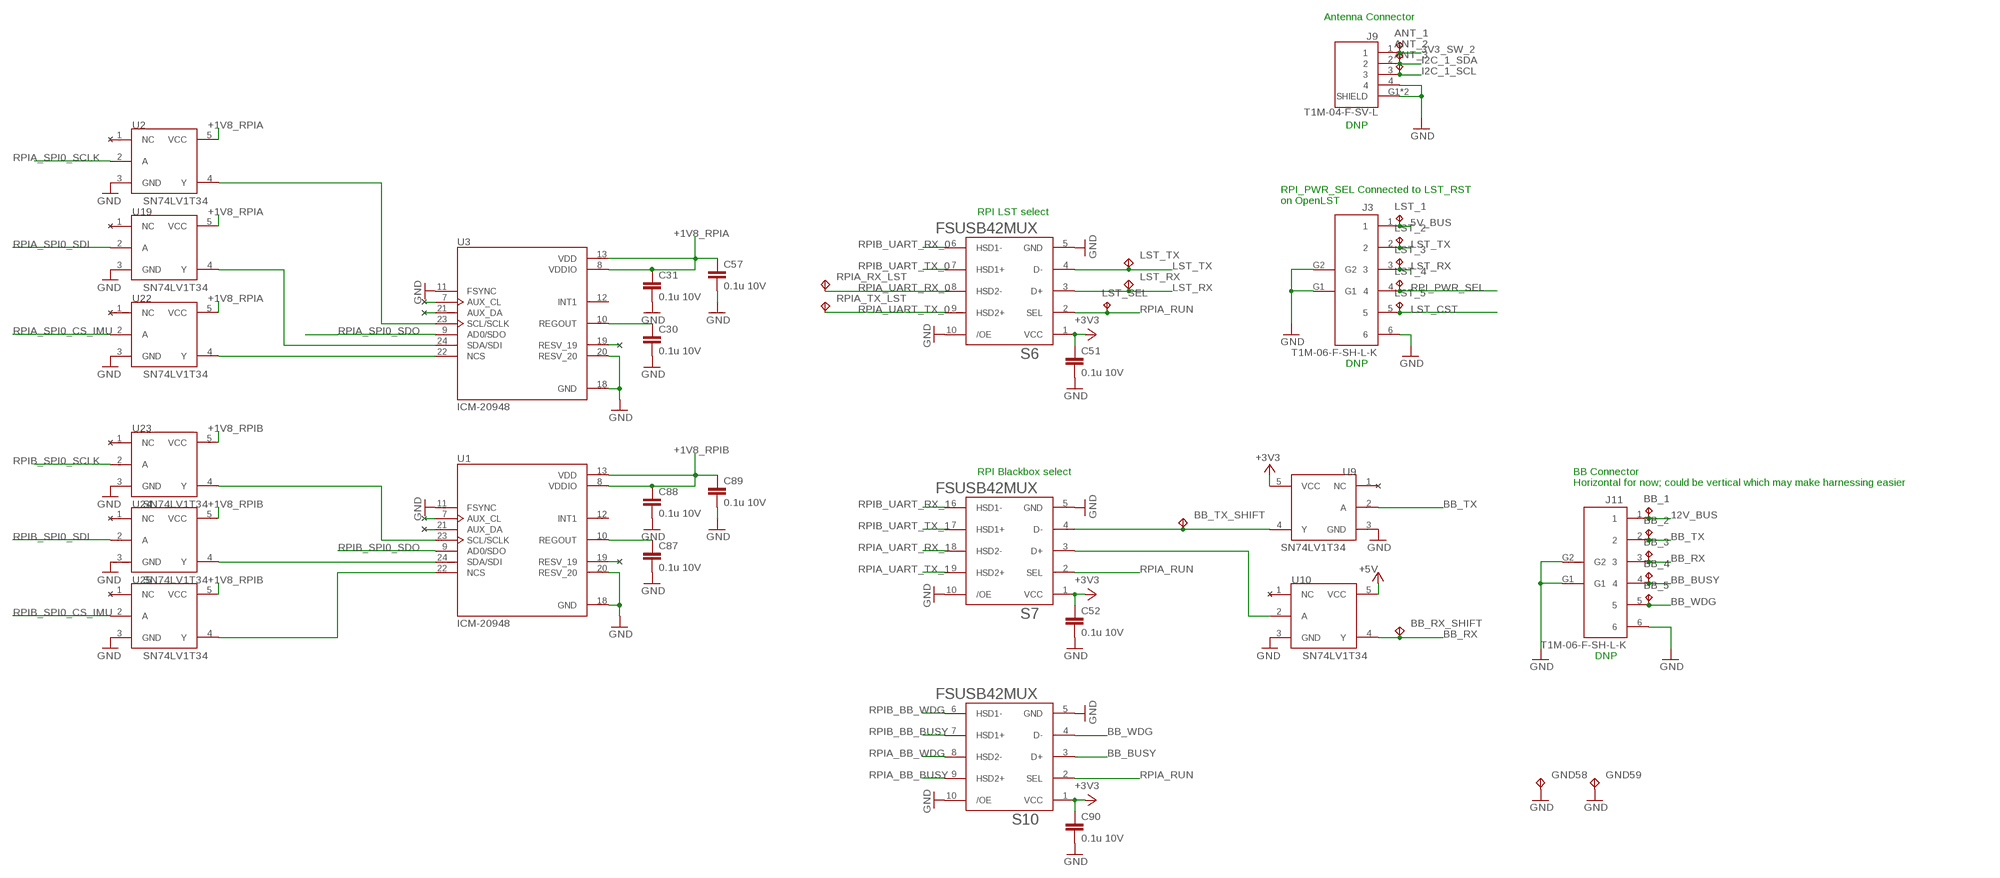
[diagram p6: schematic, sheet 4]

### Parts
ANT_1  TPTP18SQ  [TP18SQ]
ANT_2  TPTP18SQ  [TP18SQ]
ANT_3  TPTP18SQ  [TP18SQ]
BB_1  TPTP18SQ  [TP18SQ]
BB_2  TPTP18SQ  [TP18SQ]
BB_3  TPTP18SQ  [TP18SQ]
BB_4  TPTP18SQ  [TP18SQ]
BB_5  TPTP18SQ  [TP18SQ]
BB_RX_SHIFT  TP_HRWN  [TP_HRWN]
BB_TX_SHIFT  TP_HRWN  [TP_HRWN]
C30  0.1u 10V  C-EUC0603  [C0603]
C31  0.1u 10V  C-EUC0603  [C0603]
C51  0.1u 10V  C-EUC0603  [C0603]
C52  0.1u 10V  C-EUC0603  [C0603]
C57  0.1u 10V  C-EUC0603  [C0603]
C87  0.1u 10V  C-EUC0603  [C0603]
C88  0.1u 10V  C-EUC0603  [C0603]
C89  0.1u 10V  C-EUC0603  [C0603]
C90  0.1u 10V  C-EUC0603  [C0603]
GND58  TP_HRWN  [TP_HRWN]
GND59  TP_HRWN  [TP_HRWN]
J3  T1M-06-F-SH-L-K  [T1M-06-F-SH-L-K]
J9  T1M-04-F-SV-L  [SAMTEC_T1M-04-F-SV-L]
J11  T1M-06-F-SH-L-K  [T1M-06-F-SH-L-K]
LST_1  TPTP15SQ  [TP15SQ]
LST_2  TPTP15SQ  [TP15SQ]
LST_3  TPTP15SQ  [TP15SQ]
LST_4  TPTP15SQ  [TP15SQ]
LST_5  TPTP15SQ  [TP15SQ]
LST_RX  TP_HRWN  [TP_HRWN]
LST_SEL  TPB1,27  [B1,27]
LST_TX  TP_HRWN  [TP_HRWN]
RPIA_RX_LST  TP_HRWN  [TP_HRWN]
RPIA_TX_LST  TP_HRWN  [TP_HRWN]
S6  FSUSB42MUX  [FSUSB42MUX]
S7  FSUSB42MUX  [FSUSB42MUX]
S10  FSUSB42MUX  [FSUSB42MUX]
U1  ICM-20948  [QFN40P300X300X105-24N]
U2  SN74LV1T34  [SOT23-5]
U3  ICM-20948  [QFN40P300X300X105-24N]
U9  SN74LV1T34  [SOT23-5]
U10  SN74LV1T34  [SOT23-5]
U19  SN74LV1T34  [SOT23-5]
U22  SN74LV1T34  [SOT23-5]
U23  SN74LV1T34  [SOT23-5]
U24  SN74LV1T34  [SOT23-5]
U25  SN74LV1T34  [SOT23-5]

### Nets
3V3_SW_2 [Power]: ANT_1.TP J9.1 ; also sheet 1
5V_BUS [Power]: J3.1 LST_1.TP ; also sheet 1
12V_BUS [Power]: BB_1.TP J11.1 ; also sheet 1
+1V8_RPIA [Power]: C31.1 C57.1 U2.5(VCC) U3.8(VDDIO) U3.13(VDD) U19.5(VCC) U22.5(VCC) ; also sheet 1,5
+1V8_RPIB [Power]: C88.1 C89.1 U1.8(VDDIO) U1.13(VDD) U23.5(VCC) U24.5(VCC) U25.5(VCC) ; also sheet 1,5
+3V3 [Power]: C51.1 C52.1 C90.1 S6.1(VCC) S7.1(VCC) S10.1(VCC) U9.5(VCC) ; also sheet 1,2,3,5
+5V [Power]: U10.5(VCC) ; also sheet 1,2,5
BB_BUSY: BB_4.TP J11.4 S10.3(D+)
BB_RX: BB_3.TP BB_RX_SHIFT.P$1(P1) J11.3 U10.4(Y)
BB_TX: BB_2.TP J11.2 U9.2(A)
BB_WDG: BB_5.TP J11.5 S10.4(D-)
GND: C30.2 C31.2 C51.2 C52.2 C57.2 C87.2 C88.2 C89.2 C90.2 GND58.P$1(P1) GND59.P$1(P1) J3.6 J3.G1 J3.G2 J9.4 J9.G1(SHIELD) J9.G2(SHIELD) J11.6 J11.G1 J11.G2 S6.5(GND) S6.10(/OE) S7.5(GND) S7.10(/OE) S10.5(GND) S10.10(/OE) U1.11(FSYNC) U1.18(GND) U1.20(RESV_20) U2.3(GND) U3.11(FSYNC) U3.18(GND) U3.20(RESV_20) U9.3(GND) U10.3(GND) U19.3(GND) U22.3(GND) U23.3(GND) U24.3(GND) U25.3(GND) ; also sheet 1,2,3,5
I2C_1_SCL: ANT_3.TP J9.3 ; also sheet 1
I2C_1_SDA: ANT_2.TP J9.2 ; also sheet 1
LST_CST: J3.5 LST_5.TP
LST_RX: J3.3 LST_3.TP LST_RX.P$1(P1) S6.3(D+)
LST_TX: J3.2 LST_2.TP LST_TX.P$1(P1) S6.4(D-)
N$16: C87.1 U1.10(REGOUT)
N$17: U2.4(Y) U3.23(SCL/SCLK)
N$19: U3.24(SDA/SDI) U19.4(Y)
N$20: U3.22(NCS) U22.4(Y)
N$21: U1.23(SCL/SCLK) U23.4(Y)
N$22: U1.22(NCS) U25.4(Y)
N$23: U1.24(SDA/SDI) U24.4(Y)
N$24: U3.19(RESV_19)
N$25: U1.19(RESV_19)
N$46: U3.21(AUX_DA)
N$50: C30.1 U3.10(REGOUT)
N$57: U3.7(AUX_CL)
N$58: U1.7(AUX_CL)
N$59: U1.21(AUX_DA)
N$121: BB_TX_SHIFT.P$1(P1) S7.4(D-) U9.4(Y)
N$123: S7.3(D+) U10.2(A)
RPI_PWR_SEL: J3.4 LST_4.TP ; also sheet 3
RPIA_BB_BUSY: S10.9(HSD2+) ; also sheet 1
RPIA_BB_WDG: S10.8(HSD2-) ; also sheet 1
RPIA_RUN: LST_SEL.TP S6.2(SEL) S7.2(SEL) S10.2(SEL) ; also sheet 1,2,3
RPIA_SPI0_CS_IMU: U22.2(A) ; also sheet 1
RPIA_SPI0_SCLK: U2.2(A) ; also sheet 1
RPIA_SPI0_SDI: U19.2(A) ; also sheet 1
RPIA_SPI0_SDO: U3.9(AD0/SDO) ; also sheet 1
RPIA_UART_RX_0: RPIA_RX_LST.P$1(P1) S6.8(HSD2-) ; also sheet 1
RPIA_UART_RX_1: S7.8(HSD2-) ; also sheet 1
RPIA_UART_TX_0: RPIA_TX_LST.P$1(P1) S6.9(HSD2+) ; also sheet 1
RPIA_UART_TX_1: S7.9(HSD2+) ; also sheet 1
RPIB_BB_BUSY: S10.7(HSD1+) ; also sheet 1
RPIB_BB_WDG: S10.6(HSD1-) ; also sheet 1
RPIB_SPI0_CS_IMU: U25.2(A) ; also sheet 1
RPIB_SPI0_SCLK: U23.2(A) ; also sheet 1
RPIB_SPI0_SDI: U24.2(A) ; also sheet 1
RPIB_SPI0_SDO: U1.9(AD0/SDO) ; also sheet 1
RPIB_UART_RX_0: S6.6(HSD1-) ; also sheet 1
RPIB_UART_RX_1: S7.6(HSD1-) ; also sheet 1
RPIB_UART_TX_0: S6.7(HSD1+) ; also sheet 1
RPIB_UART_TX_1: S7.7(HSD1+) ; also sheet 1
Unconnected: U1.12(INT1) U2.1(NC) U3.12(INT1) U9.1(NC) U10.1(NC) U19.1(NC) U22.1(NC) U23.1(NC) U24.1(NC) U25.1(NC)

### Notes on the sheet
- Antenna Connector
- DNP
- RPI_PWR_SEL Connected to LST_RST
  on OpenLST
- RPI LST select
- DNP
- RPI Blackbox select | BB Connector
- Horizontal for now; could be vertical which may make harnessing easier
- DNP

## Sheet 5 of 5: Power
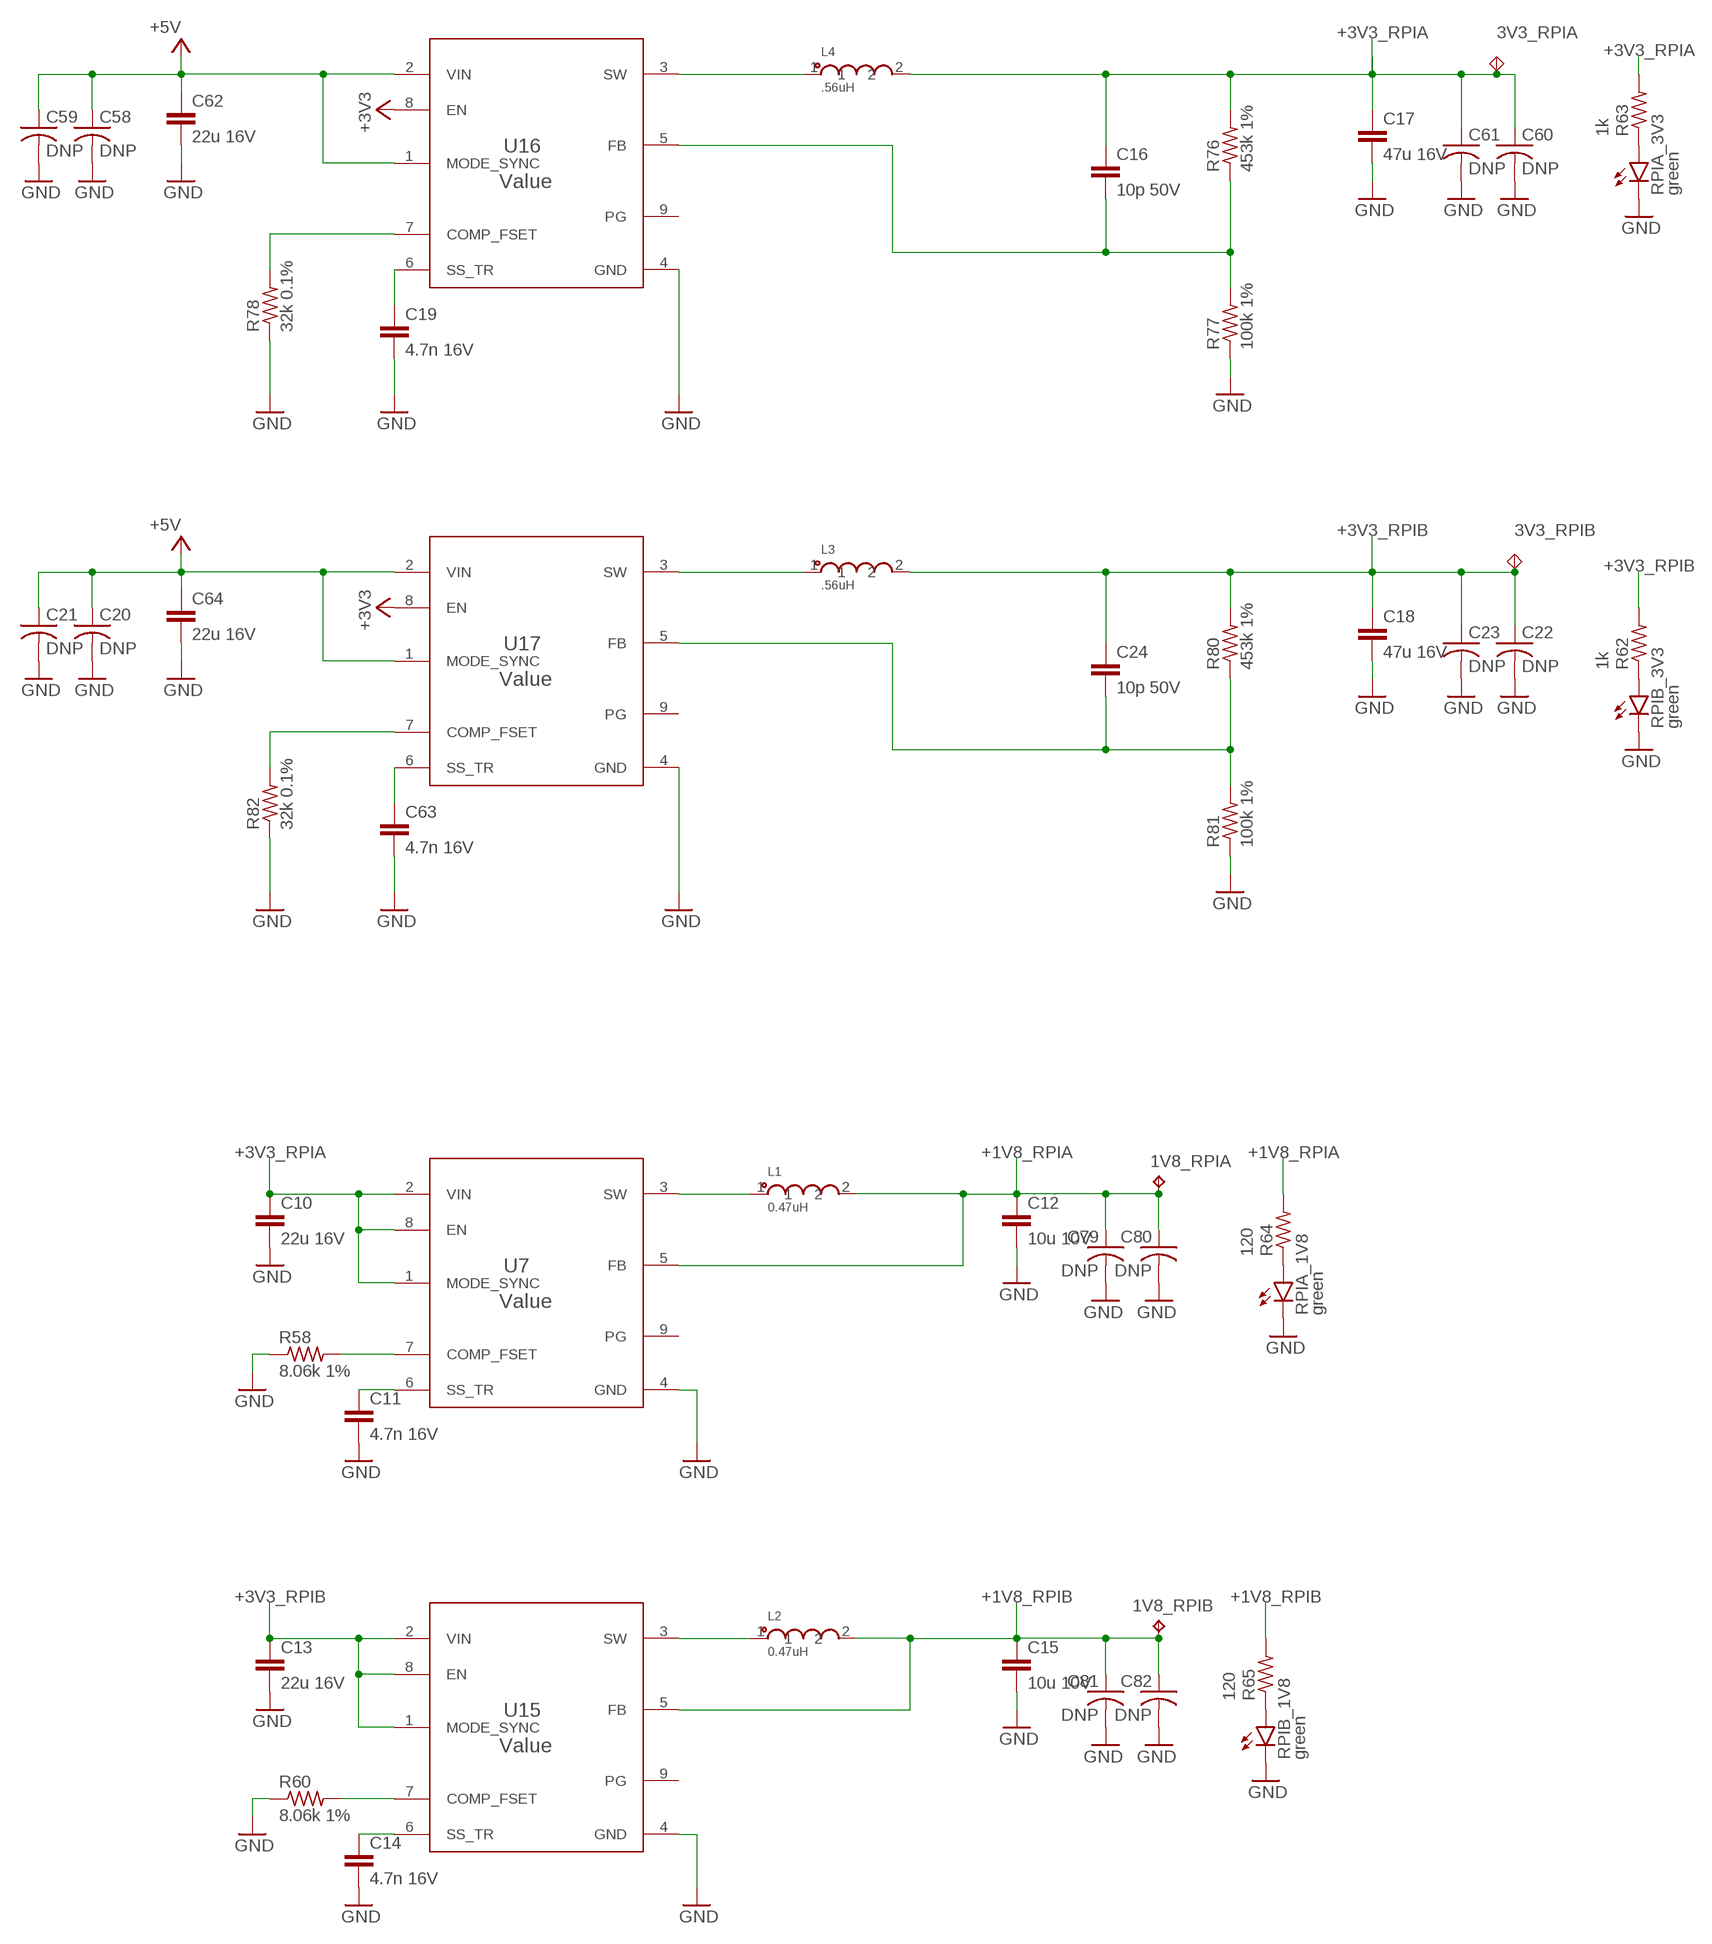
[diagram p7: schematic, sheet 5]

### Parts
1V8_RPIA  TPB1,27  [B1,27]
1V8_RPIB  TPB1,27  [B1,27]
3V3_RPIA  TP_HRWN  [TP_HRWN]
3V3_RPIB  TP_HRWN  [TP_HRWN]
C10  22u 16V  C-EUC1206  [C1206]
C11  4.7n 16V  C-EUC0603  [C0603]
C12  10u 10V  C-EUC1206  [C1206]
C13  22u 16V  C-EUC1206  [C1206]
C14  4.7n 16V  C-EUC0603  [C0603]
C15  10u 10V  C-EUC1206  [C1206]
C16  10p 50V  C-EUC0603  [C0603]
C17  47u 16V  C-EUC1210  [C1210]
C18  47u 16V  C-EUC1210  [C1210]
C19  4.7n 16V  C-EUC0603  [C0603]
C20  DNP  C-USC0805  [C0805]
C21  DNP  C-USC0805  [C0805]
C22  DNP  C-USC0805  [C0805]
C23  DNP  C-USC0805  [C0805]
C24  10p 50V  C-EUC0603  [C0603]
C58  DNP  C-USC0805  [C0805]
C59  DNP  C-USC0805  [C0805]
C60  DNP  C-USC0805  [C0805]
C61  DNP  C-USC0805  [C0805]
C62  22u 16V  C-EUC1206  [C1206]
C63  4.7n 16V  C-EUC0603  [C0603]
C64  22u 16V  C-EUC1206  [C1206]
C79  DNP  C-USC0805  [C0805]
C80  DNP  C-USC0805  [C0805]
C81  DNP  C-USC0805  [C0805]
C82  DNP  C-USC0805  [C0805]
L1  0.47uH  LPS3010  [LPS3010]
L2  0.47uH  LPS3010  [LPS3010]
L3  .56uH  LPS4018-472MRB  [INDP_LPS4018-472MRB]
L4  .56uH  LPS4018-472MRB  [INDP_LPS4018-472MRB]
R58  8.06k 1%  R-US_R0603  [R0603]
R60  8.06k 1%  R-US_R0603  [R0603]
R62  1k  R-US_R0603  [R0603]
R63  1k  R-US_R0603  [R0603]
R64  120  R-US_R0603  [R0603]
R65  120  R-US_R0603  [R0603]
R76  453k 1%  R-US_R0603  [R0603]
R77  100k 1%  R-US_R0603  [R0603]
R78  32k 0.1%  R-US_R0603  [R0603]
R80  453k 1%  R-US_R0603  [R0603]
R81  100k 1%  R-US_R0603  [R0603]
R82  32k 0.1%  R-US_R0603  [R0603]
RPIA_1V8  green  LEDSML0603  [SML0603]
RPIA_3V3  green  LEDSML0603  [SML0603]
RPIB_1V8  green  LEDSML0603  [SML0603]
RPIB_3V3  green  LEDSML0603  [SML0603]
U7  Value  TPS628112AQWRWYRQ1  [RWY0009A]
U15  Value  TPS628112AQWRWYRQ1  [RWY0009A]
U16  Value  TPS628112AQWRWYRQ1  [RWY0009A]
U17  Value  TPS628112AQWRWYRQ1  [RWY0009A]

### Nets
1: C24.2 R80.1 R81.2 U17.5(FB)
2: C16.2 R76.1 R77.2 U16.5(FB)
3: L3.1 U17.3(SW)
7: L4.1 U16.3(SW)
+1V8_RPIA [Power]: 1V8_RPIA.TP C12.1 C79.1 C80.1 L1.2 R64.2 U7.5(FB) ; also sheet 1,4
+1V8_RPIB [Power]: 1V8_RPIB.TP C15.1 C81.1 C82.1 L2.2 R65.2 U15.5(FB) ; also sheet 1,4
+3V3 [Power]: U16.8(EN) U17.8(EN) ; also sheet 1,2,3,4
+3V3_RPIA [Power]: 3V3_RPIA.P$1(P1) C10.1 C16.1 C17.1 C60.1 C61.1 L4.2 R63.2 R76.2 U7.1(MODE_SYNC) U7.2(VIN) U7.8(EN) ; also sheet 1,3
+3V3_RPIB [Power]: 3V3_RPIB.P$1(P1) C13.1 C18.1 C22.1 C23.1 C24.1 L3.2 R62.2 R80.2 U15.1(MODE_SYNC) U15.2(VIN) U15.8(EN) ; also sheet 1,3
+5V [Power]: C20.1 C21.1 C58.1 C59.1 C62.1 C64.1 U16.1(MODE_SYNC) U16.2(VIN) U17.1(MODE_SYNC) U17.2(VIN) ; also sheet 1,2,4
GND: C10.2 C11.2 C12.2 C13.2 C14.2 C15.2 C17.2 C18.2 C19.2 C20.2 C21.2 C22.2 C23.2 C58.2 C59.2 C60.2 C61.2 C62.2 C63.2 C64.2 C79.2 C80.2 C81.2 C82.2 R58.1 R60.1 R77.1 R78.1 R81.1 R82.1 RPIA_1V8.C RPIA_3V3.C RPIB_1V8.C RPIB_3V3.C U7.4(GND) U15.4(GND) U16.4(GND) U17.4(GND) ; also sheet 1,2,3,4
N$132: R78.2 U16.7(COMP_FSET)
N$133: C19.1 U16.6(SS_TR)
N$147: R82.2 U17.7(COMP_FSET)
N$148: C63.1 U17.6(SS_TR)
N$150: C11.1 U7.6(SS_TR)
N$151: R58.2 U7.7(COMP_FSET)
N$152: L1.1 U7.3(SW)
N$154: R60.2 U15.7(COMP_FSET)
N$155: C14.1 U15.6(SS_TR)
N$156: L2.1 U15.3(SW)
N$158: R62.1 RPIB_3V3.A
N$159: R63.1 RPIA_3V3.A
N$160: R64.1 RPIA_1V8.A
N$161 [Power]: R65.1 RPIB_1V8.A
Unconnected: U7.9(PG) U15.9(PG) U16.9(PG) U17.9(PG)

## Power pins joined to a net without a drawn wire
+3V3: IC4.5(VCC) IC5.5(VCC) IC6.5(VCC) IC7.16(P:VCC)
GND: IC4.3(GND) IC5.3(GND) IC6.3(GND) IC7.8(P:GND)
VBAT: U12.3(VBAT)

## Library data of the parts
1V8_RPIA 1V8_RPIB ANT_1-ANT_3 BB_1-BB_5 GPS_1-GPS_3 I2C_0_C I2C_0_D I2C_1_C I2C_1_D ID_F IR1_1-IR1_3 IR2_1-IR2_3 LST_1-LST_5 LST_SEL PIA_I2C_0_C PIA_I2C_0_D PIA_I2C_1_C PIA_I2C_1_D RPI_OTG RPIA_USB_N RPIA_USB_P RPIB_USB_N RPIB_USB_P RTC_VIN TILE_1-TILE_5 USB_SUSP_IND VIS_1-VIS_3 WD_A_MR WD_A_WDI WD_B_MR WD_B_WDI WD_RES_A WD_RES_B = testpad:TP: Test pad
3V3_RPIA 3V3_RPIB +3V3_VIN +5V_VIN BB_RX_SHIFT BB_TX_SHIFT CAM_EN G_RX G_TX GND GND49 GND51 GND53 GND55 GND58 GND59 GND62 GND64 GND66 GND70 LST_RX LST_TX PI_PWR_SEL PIA_RUN PIA_SD_SEL PIB_I2C_0_C PIB_I2C_0_D PIB_RUN PIB_SD_SEL RPIA_RX_LST RPIA_TX_LST S_USB_F S_USB_RPI T_RX T_TX W_RES_A W_RES_B = bc_custom:TP_HRWN; MPN: S2751-46R
C1-C9 C11 C14 C16-C19 C24-C57 C63 C65-C78 C83-C91 = rcl:C-EU: CAPACITOR, European symbol; SPICEPREFIX: C
C10 C12 C13 C15 C62 C64 = rcl:C-EU: CAPACITOR, European symbol; COMP: GRM31CR71A226KE15L; SPICEPREFIX: C
C20-C23 C58-C61 C79-C82 = rcl:C-US: CAPACITOR, American symbol; SPICEPREFIX: C
D1-D3 = bc_custom:PRTR5V0U2X: USB TVS Diode Ultra low capacitance double rail-to-rail ESD protection diode; MPN: PRTR5V0U2X,215
DEBUG GPS IR1 IR2 RPIA_1V8 RPIB_1V8 TILE VIS = led:LED: LED OSRAM: - CHIPLED LG R971, LG N971, LY N971, LG Q971, LY Q971, LO R971, LY R971 LH N974, LH R974 LS Q976, LO Q976, LY Q976 LO Q996 - Hyper CHIPLED LW Q18S LB Q993, LB Q99A, LB R99A - SideLED LS A670, LO A670, LY A670, LG A670, LP A670 LB A673, LV A673, LT A673, LW A673 LH A674 LY A675 LS A676, LA A676, LO A676, LY A676, LW A676 LS A679, LY A679, LG A679 - Hyper Micro SIDELED® LS Y876, LA Y876, LO Y876, LY Y876 LT Y87S - SmartLED LW L88C, LW L88S LB L89C, LB L89S, LG L890 LS L89K, LO L89K, LY L89K LS L896, LA L896, LO L896, LY L896 - TOPLED LS T670, LO T670, LY T670, LG T670, LP T670 LSG T670, LSP T670, LSY T670, LOP T670, LYG T670 LG T671, LOG T671, LSG T671 LB T673, LV T673, LT T673, LW T673 LH T674 LS T676, LA T676, LO T676, LY T676, LB T676, LH T676, LSB T676, LW T676 LB T67C, LV T67C, LT T67C, LS T67K, LO T67K, LY T67K, LW E67C LS E67B, LA E67B, LO E67B, LY E67B, LB E67C, LV E67C, LT E67C LW T67C LS T679, LY T679, LG T679 LS T770, LO T770, LY T770, LG T770, LP T770 LB T773, LV T773, LT T773, LW T773 LH T774 LS E675, LA E675, LY E675, LS T675 LS T776, LA T776, LO T776, LY T776, LB T776 LHGB T686 LT T68C, LB T68C - Hyper Mini TOPLED® LB M676 - Mini TOPLED Santana® LG M470 LS M47K, LO M47K, LY M47K Source: http://www.osram.convergy.de LUXEON: - LUMILED® LXK2-PW12-R00, LXK2-PW12-S00, LXK2-PW14-U00, LXK2-PW14-V00 LXK2-PM12-R00, LXK2-PM12-S00, LXK2-PM14-U00 LXK2-PE12-Q00, LXK2-PE12-R00, LXK2-PE12-S00, LXK2-PE14-T00, LXK2-PE14-U00 LXK2-PB12-K00, LXK2-PB12-L00, LXK2-PB12-M00, LXK2-PB14-N00, LXK2-PB14-P00, LXK2-PB14-Q00 LXK2-PR12-L00, LXK2-PR12-M00, LXK2-PR14-Q00, LXK2-PR14-R00 LXK2-PD12-Q00, LXK2-PD12-R00, LXK2-PD12-S00 LXK2-PH12-R00, LXK2-PH12-S00 LXK2-PL12-P00, LXK2-PL12-Q00, LXK2-PL12-R00 Source: www.luxeon.com KINGBRIGHT: KA-3528ASYC Source: www.kingbright.com; MPN: LG L29K-F2J1-24-Z
GPS_RX RPIA_3V3 RPIB_3V3 TILE_RX = led:LED: LED OSRAM: - CHIPLED LG R971, LG N971, LY N971, LG Q971, LY Q971, LO R971, LY R971 LH N974, LH R974 LS Q976, LO Q976, LY Q976 LO Q996 - Hyper CHIPLED LW Q18S LB Q993, LB Q99A, LB R99A - SideLED LS A670, LO A670, LY A670, LG A670, LP A670 LB A673, LV A673, LT A673, LW A673 LH A674 LY A675 LS A676, LA A676, LO A676, LY A676, LW A676 LS A679, LY A679, LG A679 - Hyper Micro SIDELED® LS Y876, LA Y876, LO Y876, LY Y876 LT Y87S - SmartLED LW L88C, LW L88S LB L89C, LB L89S, LG L890 LS L89K, LO L89K, LY L89K LS L896, LA L896, LO L896, LY L896 - TOPLED LS T670, LO T670, LY T670, LG T670, LP T670 LSG T670, LSP T670, LSY T670, LOP T670, LYG T670 LG T671, LOG T671, LSG T671 LB T673, LV T673, LT T673, LW T673 LH T674 LS T676, LA T676, LO T676, LY T676, LB T676, LH T676, LSB T676, LW T676 LB T67C, LV T67C, LT T67C, LS T67K, LO T67K, LY T67K, LW E67C LS E67B, LA E67B, LO E67B, LY E67B, LB E67C, LV E67C, LT E67C LW T67C LS T679, LY T679, LG T679 LS T770, LO T770, LY T770, LG T770, LP T770 LB T773, LV T773, LT T773, LW T773 LH T774 LS E675, LA E675, LY E675, LS T675 LS T776, LA T776, LO T776, LY T776, LB T776 LHGB T686 LT T68C, LB T68C - Hyper Mini TOPLED® LB M676 - Mini TOPLED Santana® LG M470 LS M47K, LO M47K, LY M47K Source: http://www.osram.convergy.de LUXEON: - LUMILED® LXK2-PW12-R00, LXK2-PW12-S00, LXK2-PW14-U00, LXK2-PW14-V00 LXK2-PM12-R00, LXK2-PM12-S00, LXK2-PM14-U00 LXK2-PE12-Q00, LXK2-PE12-R00, LXK2-PE12-S00, LXK2-PE14-T00, LXK2-PE14-U00 LXK2-PB12-K00, LXK2-PB12-L00, LXK2-PB12-M00, LXK2-PB14-N00, LXK2-PB14-P00, LXK2-PB14-Q00 LXK2-PR12-L00, LXK2-PR12-M00, LXK2-PR14-Q00, LXK2-PR14-R00 LXK2-PD12-Q00, LXK2-PD12-R00, LXK2-PD12-S00 LXK2-PH12-R00, LXK2-PH12-S00 LXK2-PL12-P00, LXK2-PL12-Q00, LXK2-PL12-R00 Source: www.luxeon.com KINGBRIGHT: KA-3528ASYC Source: www.kingbright.com; MPN: 150060VS75000
GPS_TX IR1_3V3 IR2_3V3 RPIA_SD_SEL RPIB_SD_SEL TILE_TX USB_F_VBUS VIS_5V = led:LED: LED OSRAM: - CHIPLED LG R971, LG N971, LY N971, LG Q971, LY Q971, LO R971, LY R971 LH N974, LH R974 LS Q976, LO Q976, LY Q976 LO Q996 - Hyper CHIPLED LW Q18S LB Q993, LB Q99A, LB R99A - SideLED LS A670, LO A670, LY A670, LG A670, LP A670 LB A673, LV A673, LT A673, LW A673 LH A674 LY A675 LS A676, LA A676, LO A676, LY A676, LW A676 LS A679, LY A679, LG A679 - Hyper Micro SIDELED® LS Y876, LA Y876, LO Y876, LY Y876 LT Y87S - SmartLED LW L88C, LW L88S LB L89C, LB L89S, LG L890 LS L89K, LO L89K, LY L89K LS L896, LA L896, LO L896, LY L896 - TOPLED LS T670, LO T670, LY T670, LG T670, LP T670 LSG T670, LSP T670, LSY T670, LOP T670, LYG T670 LG T671, LOG T671, LSG T671 LB T673, LV T673, LT T673, LW T673 LH T674 LS T676, LA T676, LO T676, LY T676, LB T676, LH T676, LSB T676, LW T676 LB T67C, LV T67C, LT T67C, LS T67K, LO T67K, LY T67K, LW E67C LS E67B, LA E67B, LO E67B, LY E67B, LB E67C, LV E67C, LT E67C LW T67C LS T679, LY T679, LG T679 LS T770, LO T770, LY T770, LG T770, LP T770 LB T773, LV T773, LT T773, LW T773 LH T774 LS E675, LA E675, LY E675, LS T675 LS T776, LA T776, LO T776, LY T776, LB T776 LHGB T686 LT T68C, LB T68C - Hyper Mini TOPLED® LB M676 - Mini TOPLED Santana® LG M470 LS M47K, LO M47K, LY M47K Source: http://www.osram.convergy.de LUXEON: - LUMILED® LXK2-PW12-R00, LXK2-PW12-S00, LXK2-PW14-U00, LXK2-PW14-V00 LXK2-PM12-R00, LXK2-PM12-S00, LXK2-PM14-U00 LXK2-PE12-Q00, LXK2-PE12-R00, LXK2-PE12-S00, LXK2-PE14-T00, LXK2-PE14-U00 LXK2-PB12-K00, LXK2-PB12-L00, LXK2-PB12-M00, LXK2-PB14-N00, LXK2-PB14-P00, LXK2-PB14-Q00 LXK2-PR12-L00, LXK2-PR12-M00, LXK2-PR14-Q00, LXK2-PR14-R00 LXK2-PD12-Q00, LXK2-PD12-R00, LXK2-PD12-S00 LXK2-PH12-R00, LXK2-PH12-S00 LXK2-PL12-P00, LXK2-PL12-Q00, LXK2-PL12-R00 Source: www.luxeon.com KINGBRIGHT: KA-3528ASYC Source: www.kingbright.com; MPN: LTST-C190CKT
H1-CONNECTOR1 H2-CONNECTOR1 = SSQ-126-XX-XXX-D:SSQ-126-XX-XXX-D: ASSEMBLY, SOCKET STRIP .025[0.64] SQ TAIL.; MPN: SSQ-126-23-G-D
IC3 IC10 = ftdichip:FT232R: Source: http://www.ftdichip.com/Documents/DataSheets/DS_FT232R_v104.pdf; MPN: FT232RL; OC_FARNELL: 1146032; OC_NEWARK: 91K9918
IC4 IC5 = 74xx-little-de:74*1G08: 2-input AND gate; MPN: SN74LVC1G08MDBVREP
IC6 = 74xx-little-de:74*1G14: Single Schmitt-Trigger Inverter Gate; MPN: SN74LVC1G14MDBVREP
IC7 = 74xx-us:74*112: Dual J-K negative edge triggered FLIP FLOP, preset and clear; MPN: SN74LVC112ADR
IC9 = maxim488_custom:MAX488: RS485 TRANSEIVER Source: Data sheet <http://datasheets.maxim-ic.com/en/ds/MAX1487-MAX491.pdf>; MF: MAXIM; MPN: MAX488ESA+; OC_FARNELL: 3534170; OC_NEWARK: 34C3921
J1 J4 = USB_c_conn:629105150521: WR-COM_USB_Micro Type B_Horizontal_SMT ; Micro Type B Horizontal SMT - 3A current at Pin1 & Pin 5 - with Pegs and THT shielding Pins - T&R Packaging Code : Con_I-O_COM_USB_2.0_B_629105150521_629105150521 <http://katalog.we-online.de/media/images/eican/Con_I-O_COM_USB_2.0_B_629105150521_pf2.jpg> Details see: http://katalog.we-online.de/em/datasheet/629105150521.pdf Created 12/08/2014, Dan Xu 2014 (C) Wurth Elektronik; MPN: 629105150521
J2 J7-J9 = T1M-04-F-Sx-L:T1M-04-F-SV-L: 1MM TERMINAL STRIP, 5PINS.; AVAILABILITY: Unavailable; DESCRIPTION: Connector Header Surface Mount 4 position 0.039 _1.00mm_; MF: Samtec Inc.; MP: T1M-04-F-SV-L; MPN: T1M-04-F-SV-L; PACKAGE: None; PRICE: None
J3 J6 J11 = bc_custom:T1M-06-F-SH-L-K: T1M 1MM TERMINAL STRIP Connector Header Surface Mount, Right Angle 6 position 0.039" (1.00mm); MPN: T1M-06-F-SH-L
J10 = T1M-04-F-Sx-L:T1M-04-F-SH-L; MPN: T1M-04-F-SH-L
JP4 RX_Y RX_Z TX_A TX_B = SparkFun-Jumpers:JUMPER-SMT_3_1-NC_PASTE: Normally closed solder jumper (1 of 2 connections) This jumper has an aperture in the stencil to allow solder paste to bridge one of the two connections. One connection is normally closed (NC), while the other is normally open (NO). Wick off the solder to open the connection. Reapply solder to reclose the connection. Apply solder to the other side instead to change the current path.
L1 L2 = LPS_4018_3010:LPS3010; MPN: LPS3010-471MRC
L3 L4 = LPS_4018_3010:LPS4018-472MRB: Power inductor, shielded, 20/30% tol, SMT, RoHS, lead-free, halogen-free; AVAILABILITY: Unavailable; DESCRIPTION: Power inductor, shielded, 20/30% tol, SMT, RoHS, lead-free, halogen-free; MF: Coilcraft; MP: LPS4018-472MRB; MPN: LPS4018-561MRC; PACKAGE: None; PRICE: None
R1-R82 R87-R89 R91 = rcl:R-US_: RESISTOR, American symbol; SPICEPREFIX: R
R83-R86 = resistor:R-US_: RESISTOR, American symbol
RPIA_RUN RPIB_RUN = led:LED: LED OSRAM: - CHIPLED LG R971, LG N971, LY N971, LG Q971, LY Q971, LO R971, LY R971 LH N974, LH R974 LS Q976, LO Q976, LY Q976 LO Q996 - Hyper CHIPLED LW Q18S LB Q993, LB Q99A, LB R99A - SideLED LS A670, LO A670, LY A670, LG A670, LP A670 LB A673, LV A673, LT A673, LW A673 LH A674 LY A675 LS A676, LA A676, LO A676, LY A676, LW A676 LS A679, LY A679, LG A679 - Hyper Micro SIDELED® LS Y876, LA Y876, LO Y876, LY Y876 LT Y87S - SmartLED LW L88C, LW L88S LB L89C, LB L89S, LG L890 LS L89K, LO L89K, LY L89K LS L896, LA L896, LO L896, LY L896 - TOPLED LS T670, LO T670, LY T670, LG T670, LP T670 LSG T670, LSP T670, LSY T670, LOP T670, LYG T670 LG T671, LOG T671, LSG T671 LB T673, LV T673, LT T673, LW T673 LH T674 LS T676, LA T676, LO T676, LY T676, LB T676, LH T676, LSB T676, LW T676 LB T67C, LV T67C, LT T67C, LS T67K, LO T67K, LY T67K, LW E67C LS E67B, LA E67B, LO E67B, LY E67B, LB E67C, LV E67C, LT E67C LW T67C LS T679, LY T679, LG T679 LS T770, LO T770, LY T770, LG T770, LP T770 LB T773, LV T773, LT T773, LW T773 LH T774 LS E675, LA E675, LY E675, LS T675 LS T776, LA T776, LO T776, LY T776, LB T776 LHGB T686 LT T68C, LB T68C - Hyper Mini TOPLED® LB M676 - Mini TOPLED Santana® LG M470 LS M47K, LO M47K, LY M47K Source: http://www.osram.convergy.de LUXEON: - LUMILED® LXK2-PW12-R00, LXK2-PW12-S00, LXK2-PW14-U00, LXK2-PW14-V00 LXK2-PM12-R00, LXK2-PM12-S00, LXK2-PM14-U00 LXK2-PE12-Q00, LXK2-PE12-R00, LXK2-PE12-S00, LXK2-PE14-T00, LXK2-PE14-U00 LXK2-PB12-K00, LXK2-PB12-L00, LXK2-PB12-M00, LXK2-PB14-N00, LXK2-PB14-P00, LXK2-PB14-Q00 LXK2-PR12-L00, LXK2-PR12-M00, LXK2-PR14-Q00, LXK2-PR14-R00 LXK2-PD12-Q00, LXK2-PD12-R00, LXK2-PD12-S00 LXK2-PH12-R00, LXK2-PH12-S00 LXK2-PL12-P00, LXK2-PL12-Q00, LXK2-PL12-R00 Source: www.luxeon.com KINGBRIGHT: KA-3528ASYC Source: www.kingbright.com; MPN: SM0805AC
S1-S3 = bc_custom:AAT4616: Integrated Load Switch; MPN: AAT4616IGV-T1
S4-S10 = bc_custom:FSUSB42MUX: USB Switch ICs Low Power, Two-Port USB 2.0 (480Mbps); MPN: FSUSB42MUX
U1 U3 = ICM-20948:ICM-20948: Axis=3 Axis Gyro+3 Axis Accel+Compass. Pin For Pin With m; AVAILABILITY: Unavailable; DESCRIPTION: Accelerometer, Gyroscope, Magnetometer, 9 Axis Sensor I²C, SPI Output; MF: TDK InvenSense; MP: ICM-20948; MPN: ICM-20948; PACKAGE: TFQFN-24 TDK InvenSense; PRICE: None
U2 U9 U10 U19 U22-U25 = bc_custom:SN74LV1T34; MPN: SN74LV1T34DBVR
U4 U11 U13 U14 = bc_custom:FSSD06-MLP: SD/SDIO and MMC Two-Port Multiplexer; MPN: FSSD06BQX
U5 U6 = bc_custom:AMD6316: Supervisory Circuits with Watchdog and Manual Reset in 5-Lead SOT-23; MPN: ADM6320CZ29ARJZ-R7
U7 U15 = TI_1V8_Vreg_comp:TPS628112AQWRWYRQ1; MANUFACTURER: Texas Instruments; MPN: TPS628112MQWRWYRQ1; PARTNUMBER: TPS628112MQWRWYRQ1; REFDES: RefDes; TYPE: TYPE
U8 = USB2517I-JZX:USB2517I-JZX: High Speed High Speed Hub Controller USB 2.0 3.3V Tray 64-Pin QFN; AVAILABILITY: Unavailable; DESCRIPTION: USB Controller USB 2.0 Parallel Interface 64-QFN _9x9_; MF: Microchip; MP: USB2517I-JZX; MPN: USB2517I-JZX-TR; PACKAGE: - Microchip; PRICE: None
U12 = rtc:MCP7940MT-I/SN; BUILT_BY: EMA_Jessica; COPYRIGHT: Copyright (C) 2018 Accelerated Designs. All rights reserved; MANUFACTURER_PART_NUMBER: MCP7940MT-I/SN; MPN: MCP7940MT-I/SN; VENDOR: Microchip
U16 U17 = TI_1V8_Vreg_comp:TPS628112AQWRWYRQ1; MANUFACTURER: Texas Instruments; MPN: TPS62812QWRWYRQ1; PARTNUMBER: TPS62812QWRWYRQ1; REFDES: RefDes; TYPE: TYPE
U18 = bc_custom:RH100; MPN: RH100-24.000-20-3050-EXT-TR
U20 U21 = ethansit_rpi_CM3L:COMPUTE_MODULE: Raspberry Pi Compute Module www.hasseb.fi; MPN: 1473005-4
X1 X2 X5 X6 = bc_custom:1040310811: CONN MICRO SD CARD PUSH-PULL R/A; MPN: 1040310811
X4 = bc_custom:TC-135; C: 7pF; MPN: FC-135 32.768KA-AG0